# EAGLE schematic rt1060r2 (EAGLE 9.6.2), part 1 of 2

## Sheet 1 of 15
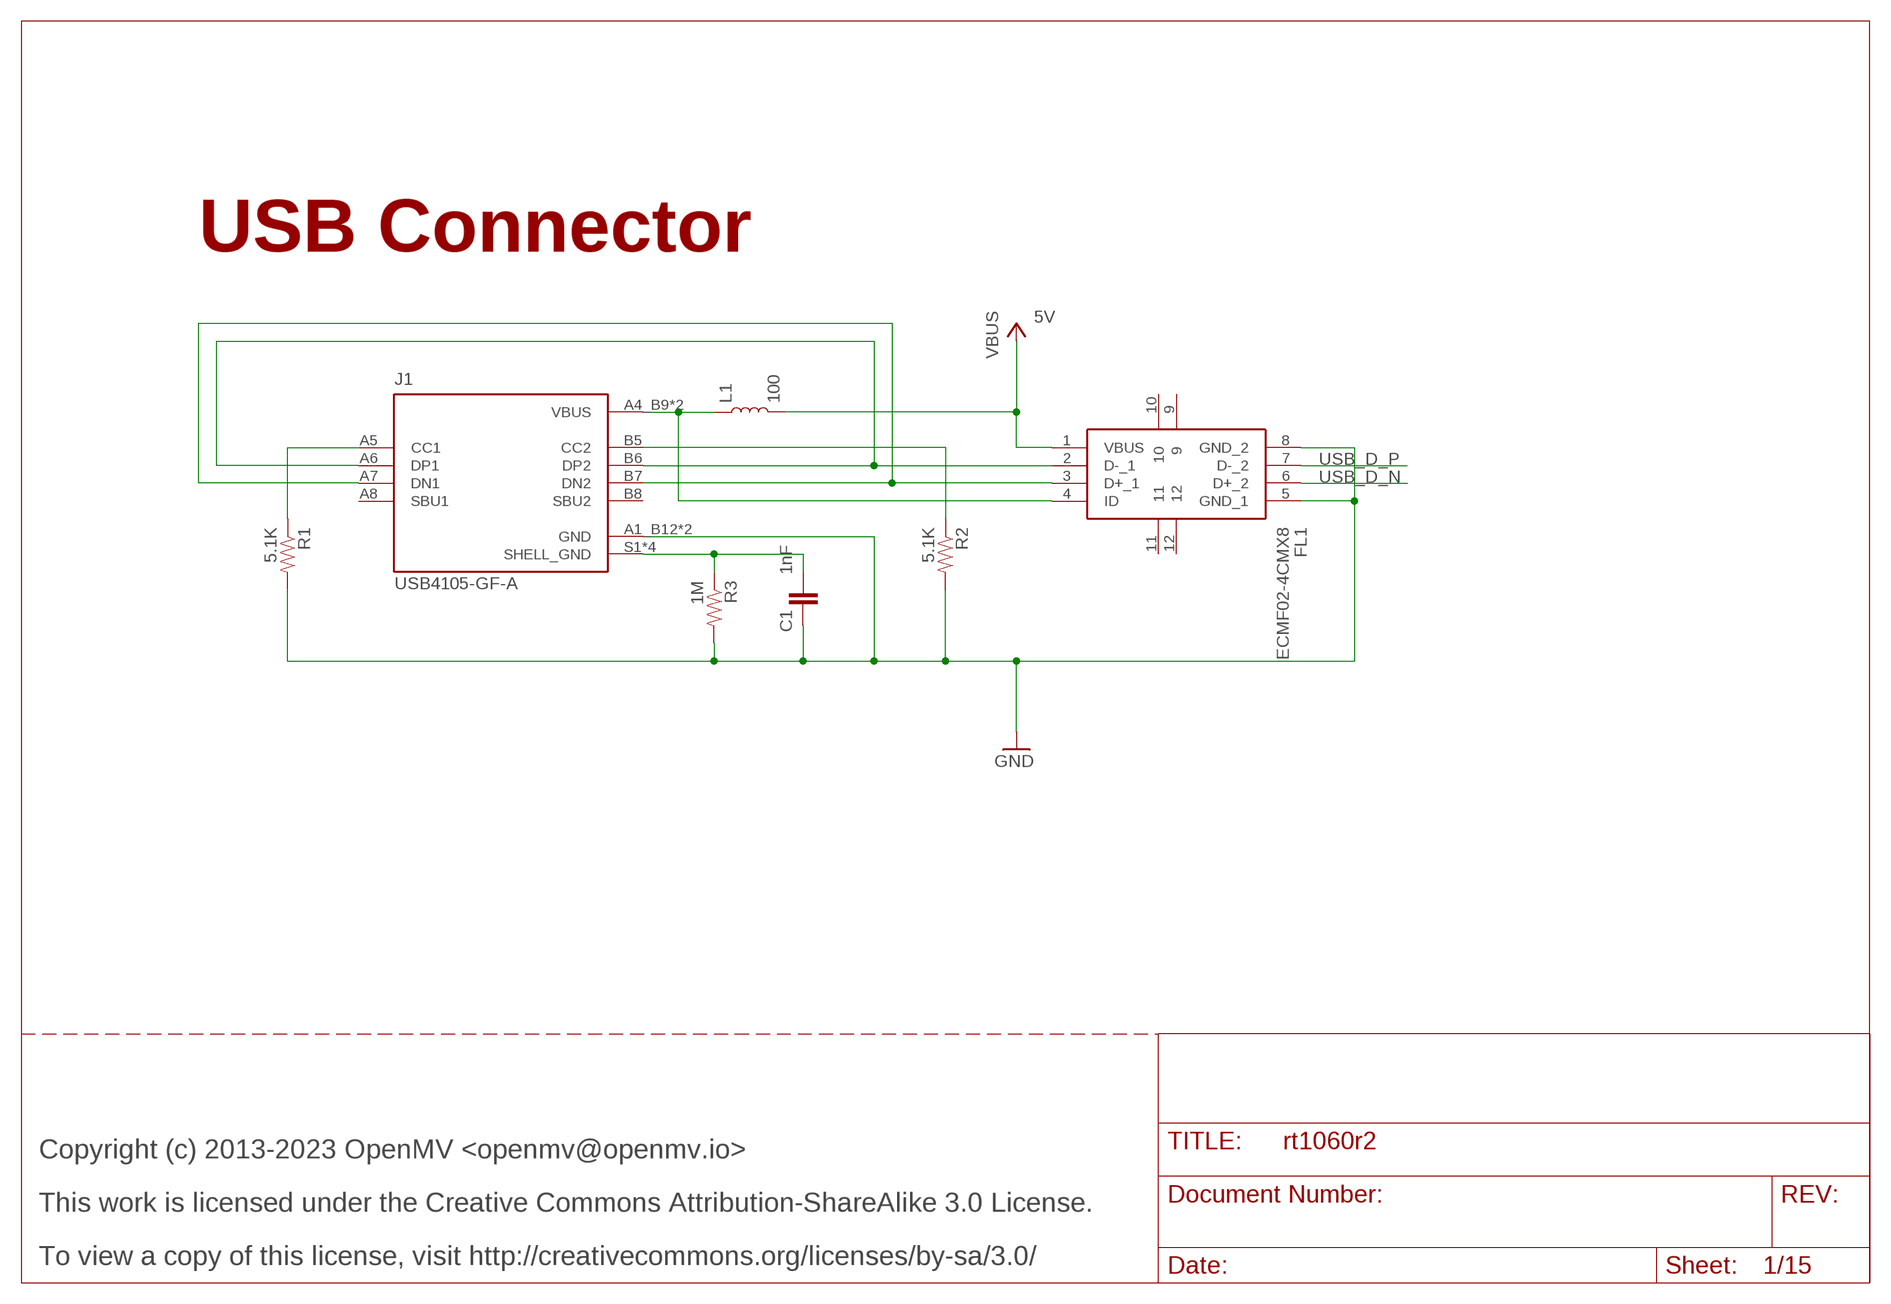
[diagram p0: schematic, sheet 1]

### Parts
C1  1nF  CAP_0402  [0402]
FL1  ECMF02-4CMX8  [ECMF024CMX8]
J1  USB4105-GF-A  [GCT_USB4105-GF-A]
L1  100  INDUCTOR-0603-33NH  [0603]
R1  5.1K  RES_0402  [0402]
R2  5.1K  RES_0402  [0402]
R3  1M  RES_0402  [0402]

### Nets
CC1: J1.A5(CC1) R1.1
CC2: J1.B5(CC2) R2.1
D_N [usb]: FL1.3(D+_1) J1.A7(DN1) J1.B7(DN2)
D_P [usb]: FL1.2(D-_1) J1.A6(DP1) J1.B6(DP2)
GND [gnd]: C1.1 FL1.5(GND_1) FL1.8(GND_2) J1.A1_B12(GND) J1.B1_A12(GND) R1.2 R2.2 R3.2 ; also sheet 2,3,4,5,6,7,8,9,10,11,12,13,14,15
SHELL_GND [power]: C1.2 J1.S1(SHELL_GND) J1.S2(SHELL_GND) J1.S3(SHELL_GND) J1.S4(SHELL_GND) R3.1
USB_D_N [usb]: FL1.6(D+_2) ; also sheet 15
USB_D_P [usb]: FL1.7(D-_2) ; also sheet 15
USB_VBUS: FL1.4(ID) J1.A4_B9(VBUS) J1.B4_A9(VBUS) L1.1
VBUS: FL1.1(VBUS) L1.2 ; also sheet 2,15
Unconnected: FL1.9 FL1.10 FL1.11 FL1.12 J1.A8(SBU1) J1.B8(SBU2)

### Notes on the sheet
- USB Connector
- 5V
- Copyright (c) 2013-2023 OpenMV <openmv@openmv.io>
- This work is licensed under the Creative Commons Attribution-ShareAlike 3.0 License.
- To view a copy of this license, visit http://creativecommons.org/licenses/by-sa/3.0/

## Sheet 2 of 15
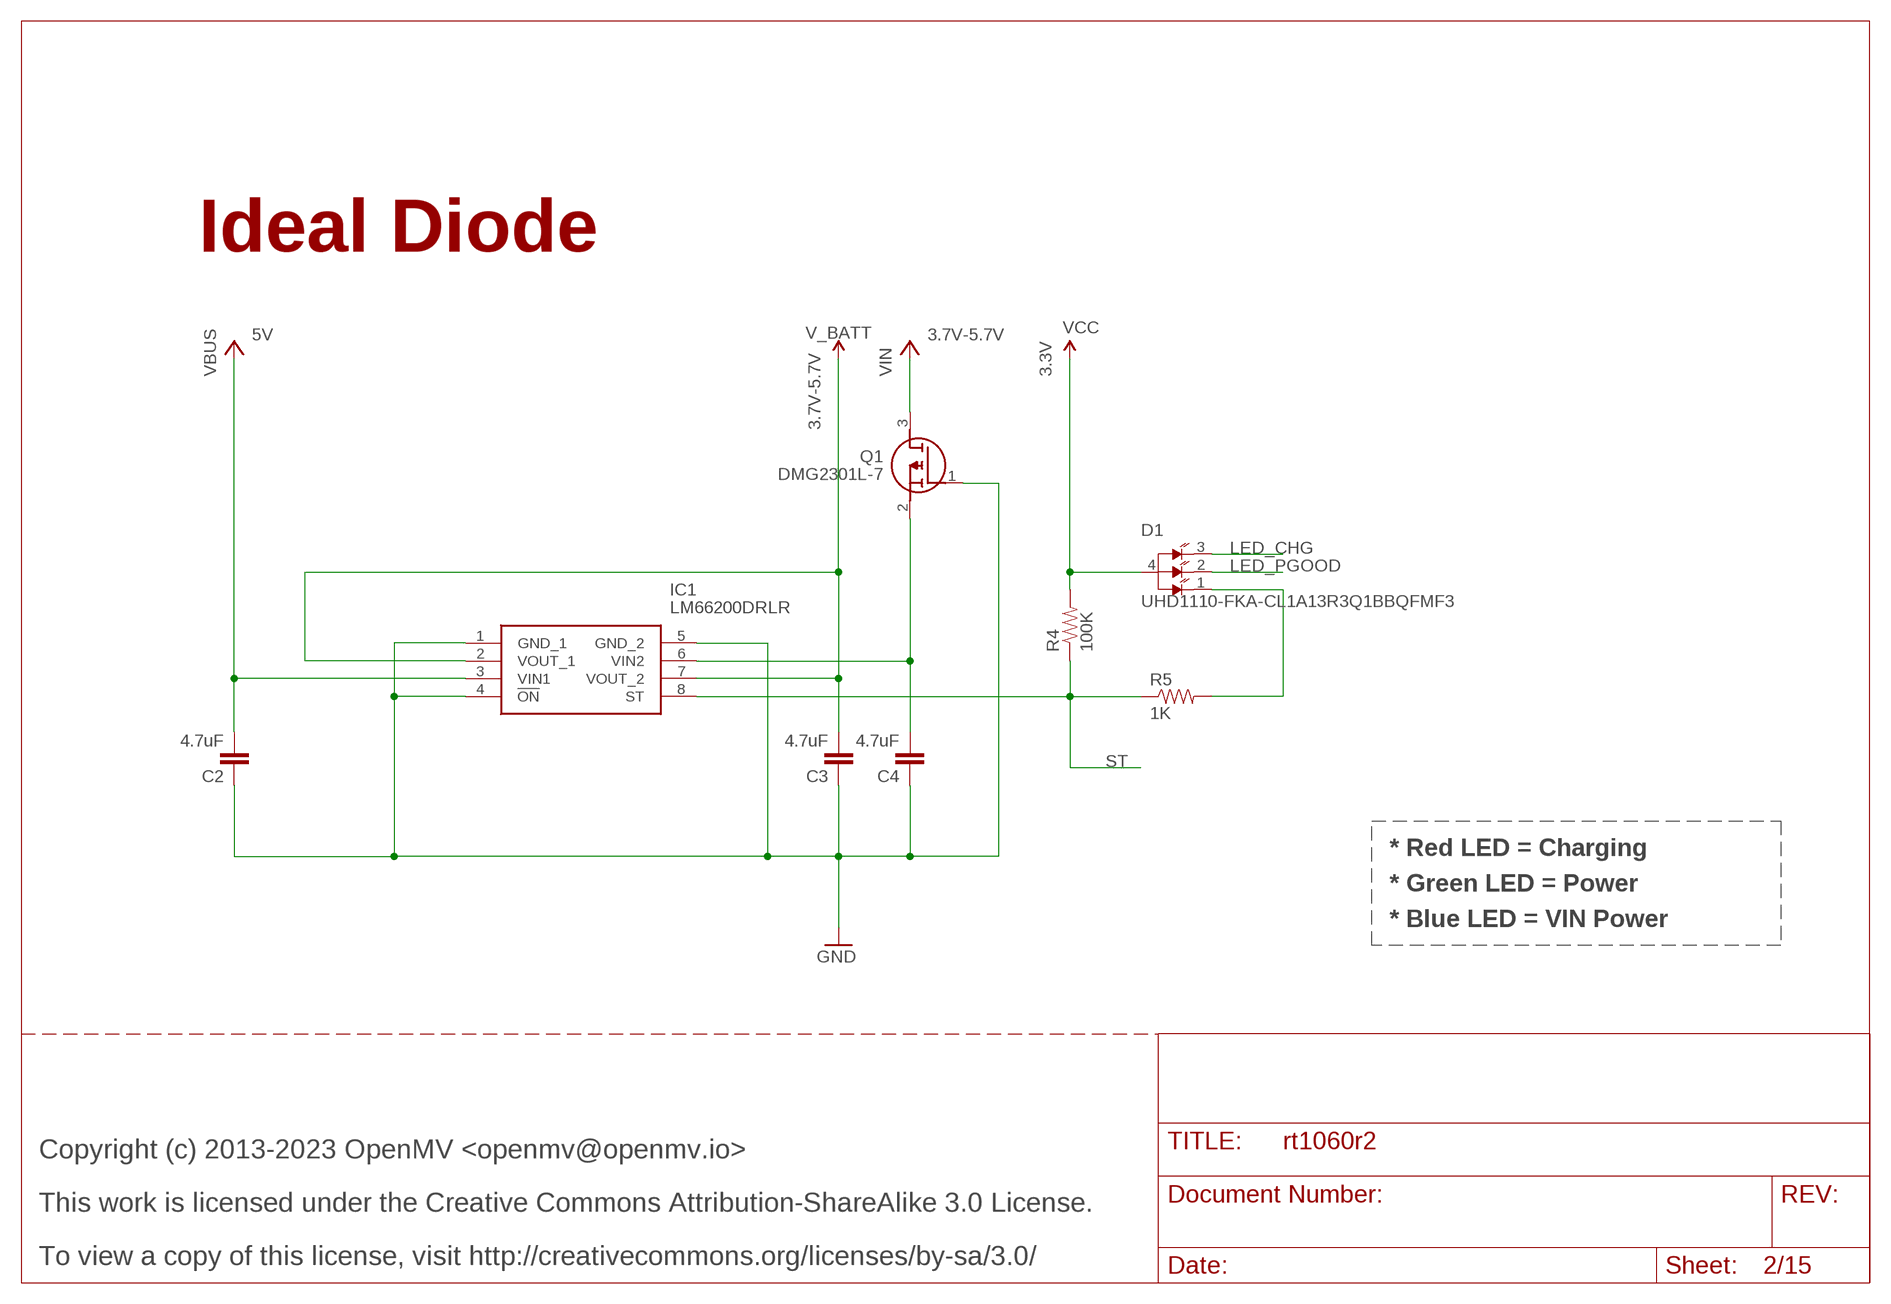
[diagram p1: schematic, sheet 2]

### Parts
C2  4.7uF  CAP_0402  [0402]
C3  4.7uF  CAP_0402  [0402]
C4  4.7uF  CAP_0402  [0402]
D1  UHD1110-FKA-CL1A13R3Q1BBQFMF3  [LED_UHD1110-FKA-CL1A13R3Q1BBQFMF3]
IC1  LM66200DRLR  [SOTFL50P160X60-8N]
Q1  DMG2301L-7  [SOT96P240X110-3N]
R4  100K  RES_0402  [0402]
R5  1K  RES_0402  [0402]

### Nets
GND [gnd]: C2.1 C3.1 C4.1 IC1.1(GND_1) IC1.4(!ON) IC1.5(GND_2) Q1.1(G) ; also sheet 1,3,4,5,6,7,8,9,10,11,12,13,14,15
LED_CHG: D1.3(RED) ; also sheet 3
LED_PGOOD: D1.2(GREEN) ; also sheet 3
LED_ST: D1.1(BLUE) R5.2
ST: IC1.8(ST) R4.1 R5.1 ; also sheet 12
V_BATT [power]: C3.2 IC1.2(VOUT_1) IC1.7(VOUT_2) ; also sheet 3
VBUS: C2.2 IC1.3(VIN1) ; also sheet 1,15
VCC: D1.4(ANODE) R4.2 ; also sheet 3,5,6,7,8,9,10,11,12,13,14,15
VIN [power]: Q1.3(D) ; also sheet 11
VIN_INT [power]: C4.2 IC1.6(VIN2) Q1.2(S)

### Notes on the sheet
- Ideal Diode
- 5V | 3.7V-5.7V
- 3.3V
- 3.7V-5.7V
- * Red LED = Charging
- * Green LED = Power
- * Blue LED = VIN Power
- Copyright (c) 2013-2023 OpenMV <openmv@openmv.io>
- This work is licensed under the Creative Commons Attribution-ShareAlike 3.0 License.
- To view a copy of this license, visit http://creativecommons.org/licenses/by-sa/3.0/

## Sheet 3 of 15
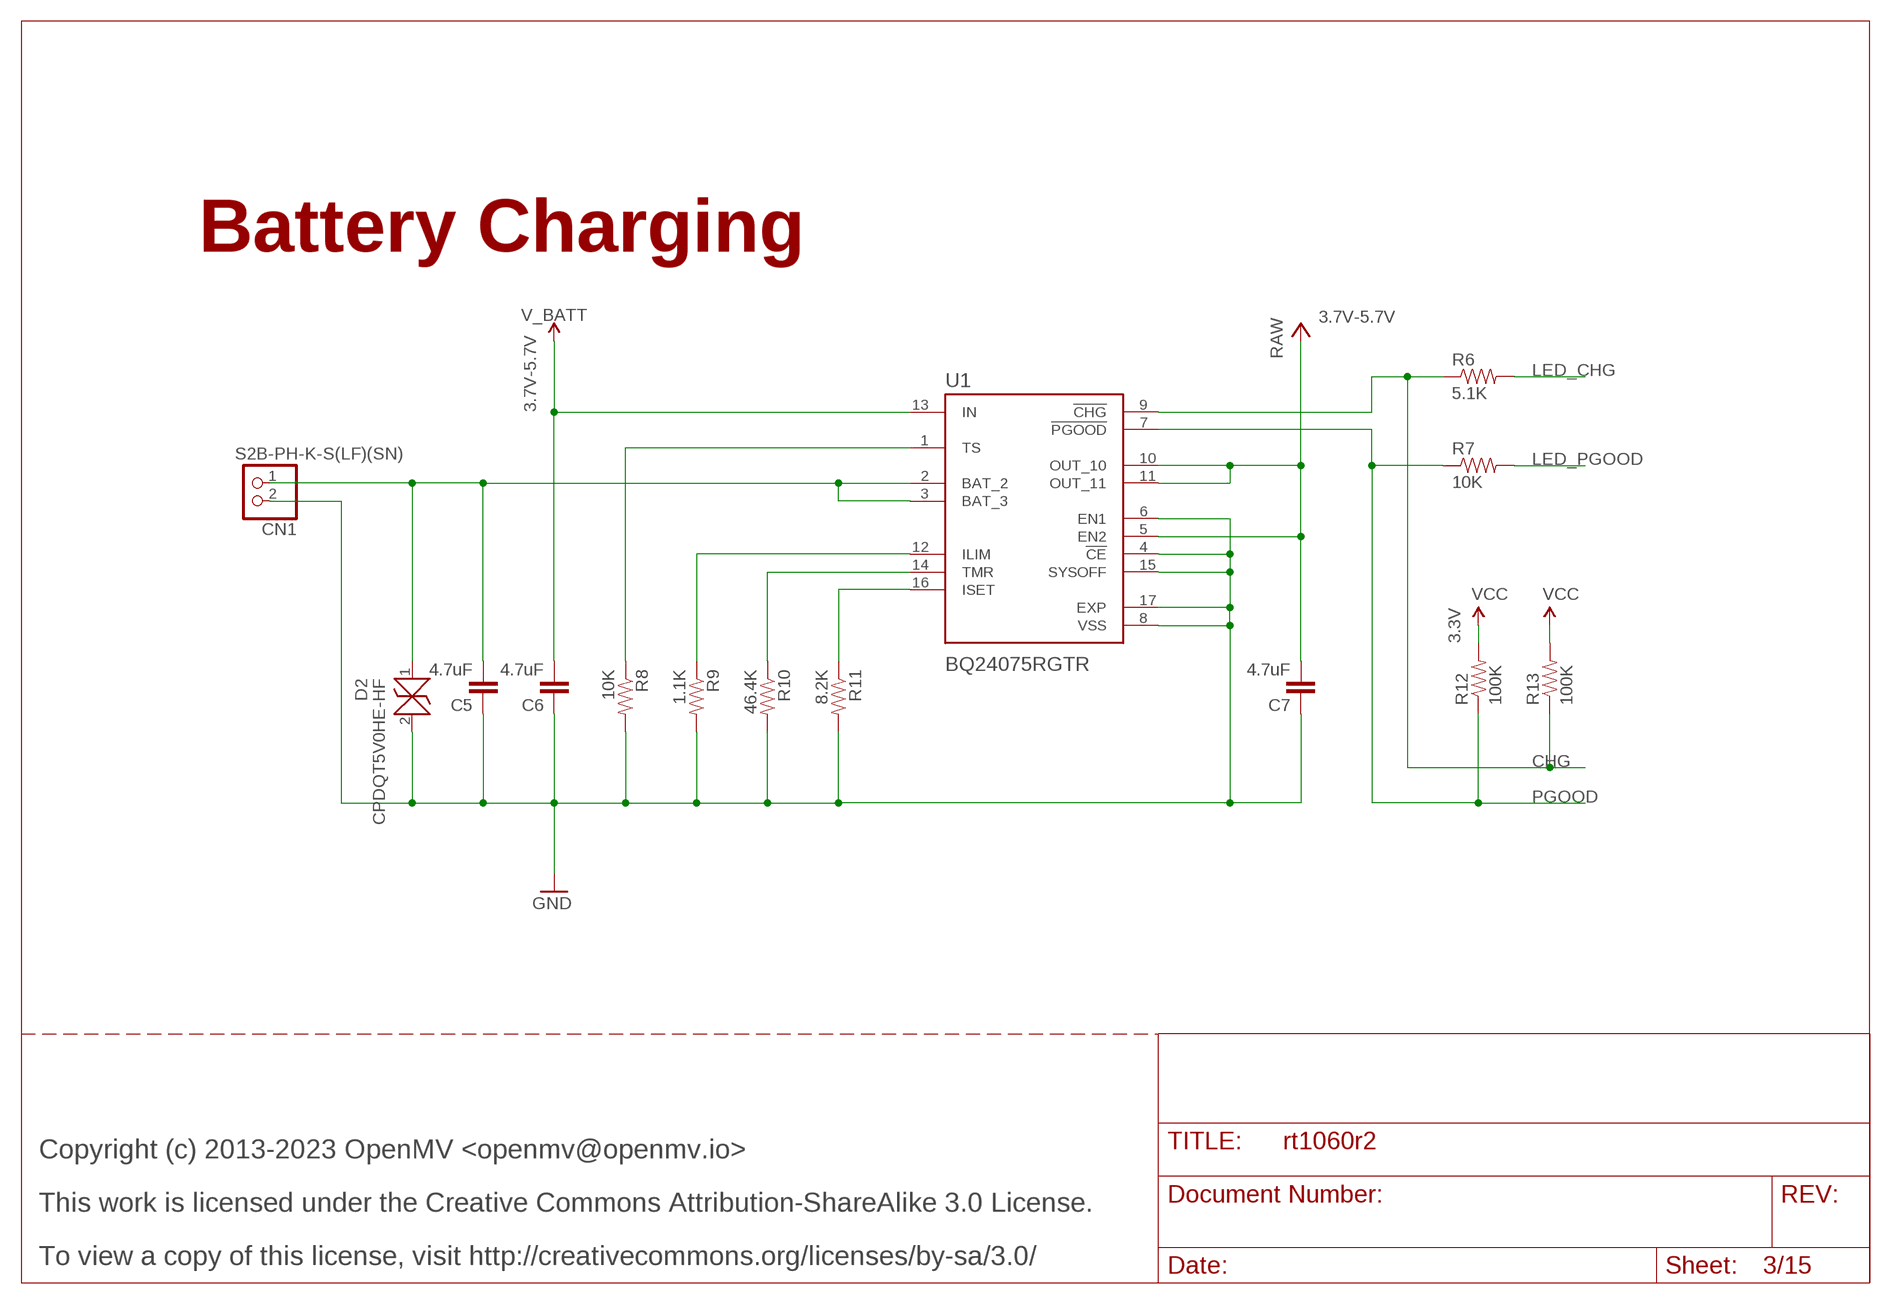
[diagram p2: schematic, sheet 3]

### Parts
C5  4.7uF  CAP_0402  [0402]
C6  4.7uF  CAP_0402  [0402]
C7  4.7uF  CAP_0402  [0402]
CN1  S2B-PH-K-S(LF)(SN)  JST_2PIN-THM-RA  [JST-PH-2-THM-RA]
D2  CPDQT5V0HE-HF  [CPDQT5V0HEHF]
R6  5.1K  RES_0402  [0402]
R7  10K  RES_0402  [0402]
R8  10K  RES_0402  [0402]
R9  1.1K  RES_0402  [0402]
R10  46.4K  RES_0402  [0402]
R11  8.2K  RES_0402  [0402]
R12  100K  RES_0402  [0402]
R13  100K  RES_0402  [0402]
U1  BQ24075RGTR  [QFN50P300X300X100-17N]

### Nets
BAT [power]: C5.2 CN1.1 D2.1 U1.2(BAT_2) U1.3(BAT_3)
CHG: R6.1 R13.1 U1.9(!CHG) ; also sheet 12
GND [gnd]: C5.1 C6.1 C7.1 CN1.2 D2.2 R8.2 R9.2 R10.2 R11.2 U1.4(!CE) U1.6(EN1) U1.8(VSS) U1.15(SYSOFF) U1.17(EXP) ; also sheet 1,2,4,5,6,7,8,9,10,11,12,13,14,15
ILIM [power]: R9.1 U1.12(ILIM)
ISET [power]: R11.1 U1.16(ISET)
LED_CHG: R6.2 ; also sheet 2
LED_PGOOD: R7.2 ; also sheet 2
PGOOD: R7.1 R12.1 U1.7(!PGOOD) ; also sheet 15
RAW: C7.2 U1.5(EN2) U1.10(OUT_10) U1.11(OUT_11) ; also sheet 4,5,11
TMR [power]: R10.1 U1.14(TMR)
TS [power]: R8.1 U1.1(TS)
V_BATT [power]: C6.2 U1.13(IN) ; also sheet 2
VCC: R12.2 R13.2 ; also sheet 2,5,6,7,8,9,10,11,12,13,14,15

### Notes on the sheet
- Battery Charging
- 3.7V-5.7V
- 3.7V-5.7V
- 3.3V
- Copyright (c) 2013-2023 OpenMV <openmv@openmv.io>
- This work is licensed under the Creative Commons Attribution-ShareAlike 3.0 License.
- To view a copy of this license, visit http://creativecommons.org/licenses/by-sa/3.0/

## Sheet 4 of 15
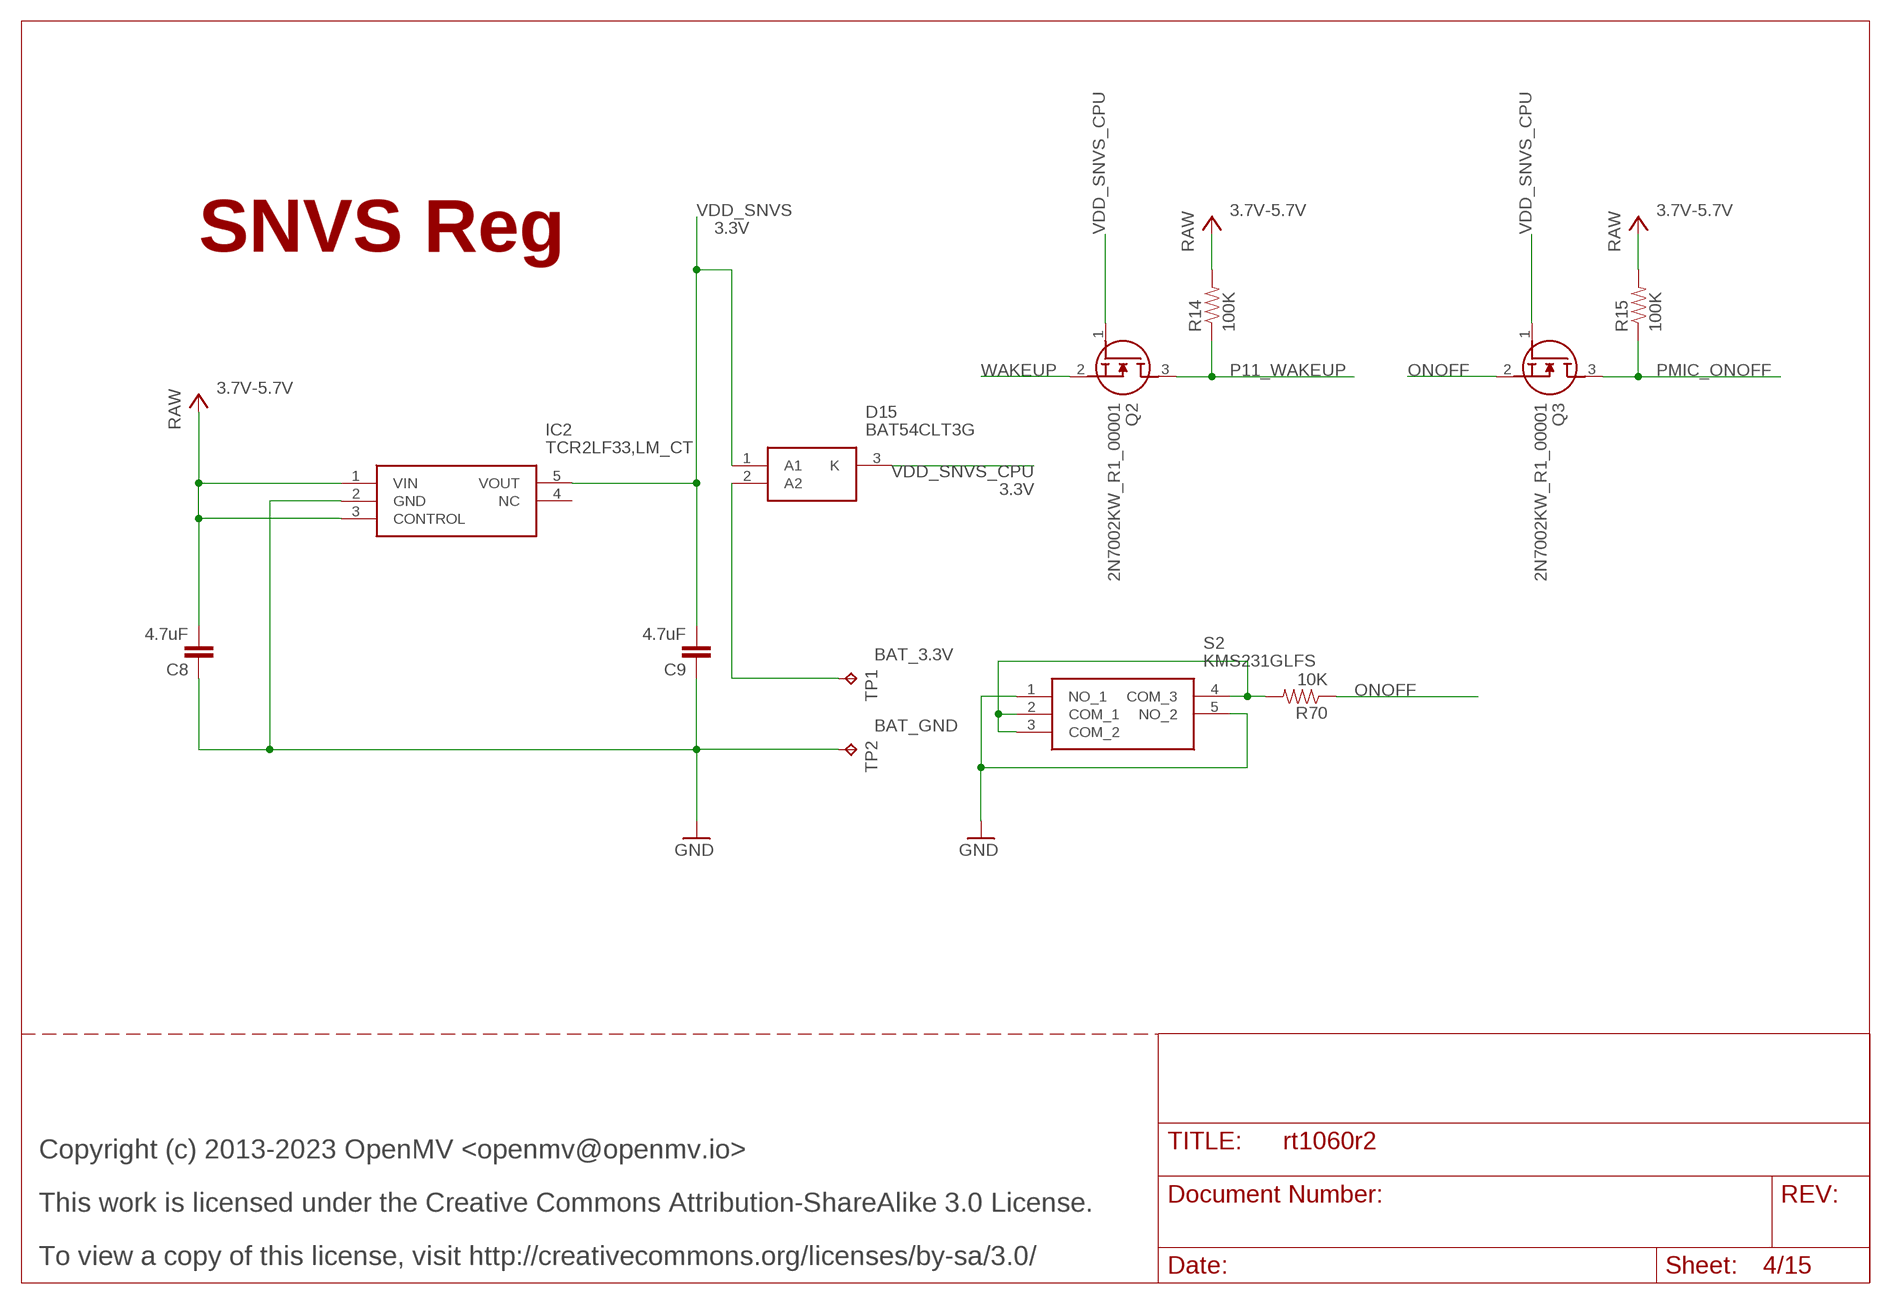
[diagram p3: schematic, sheet 4]

### Parts
C8  4.7uF  CAP_0402  [0402]
C9  4.7uF  CAP_0402  [0402]
D15  BAT54CLT3G  [SOT96P237X111-3N]
IC2  TCR2LF33,LM_CT  [TCR2LF33LMCT]
Q2  2N7002KW_R1_00001  [SOT65P210X110-3N]
Q3  2N7002KW_R1_00001  [SOT65P210X110-3N]
R14  100K  RES_0402  [0402]
R15  100K  RES_0402  [0402]
R70  10K  RES_0402  [0402]
S2  KMS231GLFS  [KMS231GLFS]
TP1  TPTP10R  [TP10R]
TP2  TPTP10R  [TP10R]

### Nets
GND [gnd]: C8.1 C9.1 IC2.2(GND) S2.1(NO_1) S2.5(NO_2) TP2.TP ; also sheet 1,2,3,5,6,7,8,9,10,11,12,13,14,15
ONOFF: Q3.2(S) R70.1 ; also sheet 15
ONOFF_BUTTON: R70.2 S2.2(COM_1) S2.3(COM_2) S2.4(COM_3)
P11_WAKEUP: Q2.3(D) R14.1 ; also sheet 11
PMIC_ONOFF: Q3.3(D) R15.1 ; also sheet 11
RAW: C8.2 IC2.1(VIN) IC2.3(CONTROL) R14.2 R15.2 ; also sheet 3,5,11
SNVS_BAT: D15.2(A2) TP1.TP
VDD_SNVS: C9.2 D15.1(A1) IC2.5(VOUT)
VDD_SNVS_CPU: D15.3(K) Q2.1(G) Q3.1(G) ; also sheet 5,15
WAKEUP: Q2.2(S) ; also sheet 15
Unconnected: IC2.4(NC)

### Notes on the sheet
- 3.7V-5.7V | 3.7V-5.7V
- 3.3V
- SNVS Reg
- 3.7V-5.7V
- 3.3V
- BAT_3.3V
- BAT_GND
- Copyright (c) 2013-2023 OpenMV <openmv@openmv.io>
- This work is licensed under the Creative Commons Attribution-ShareAlike 3.0 License.
- To view a copy of this license, visit http://creativecommons.org/licenses/by-sa/3.0/

## Sheet 5 of 15
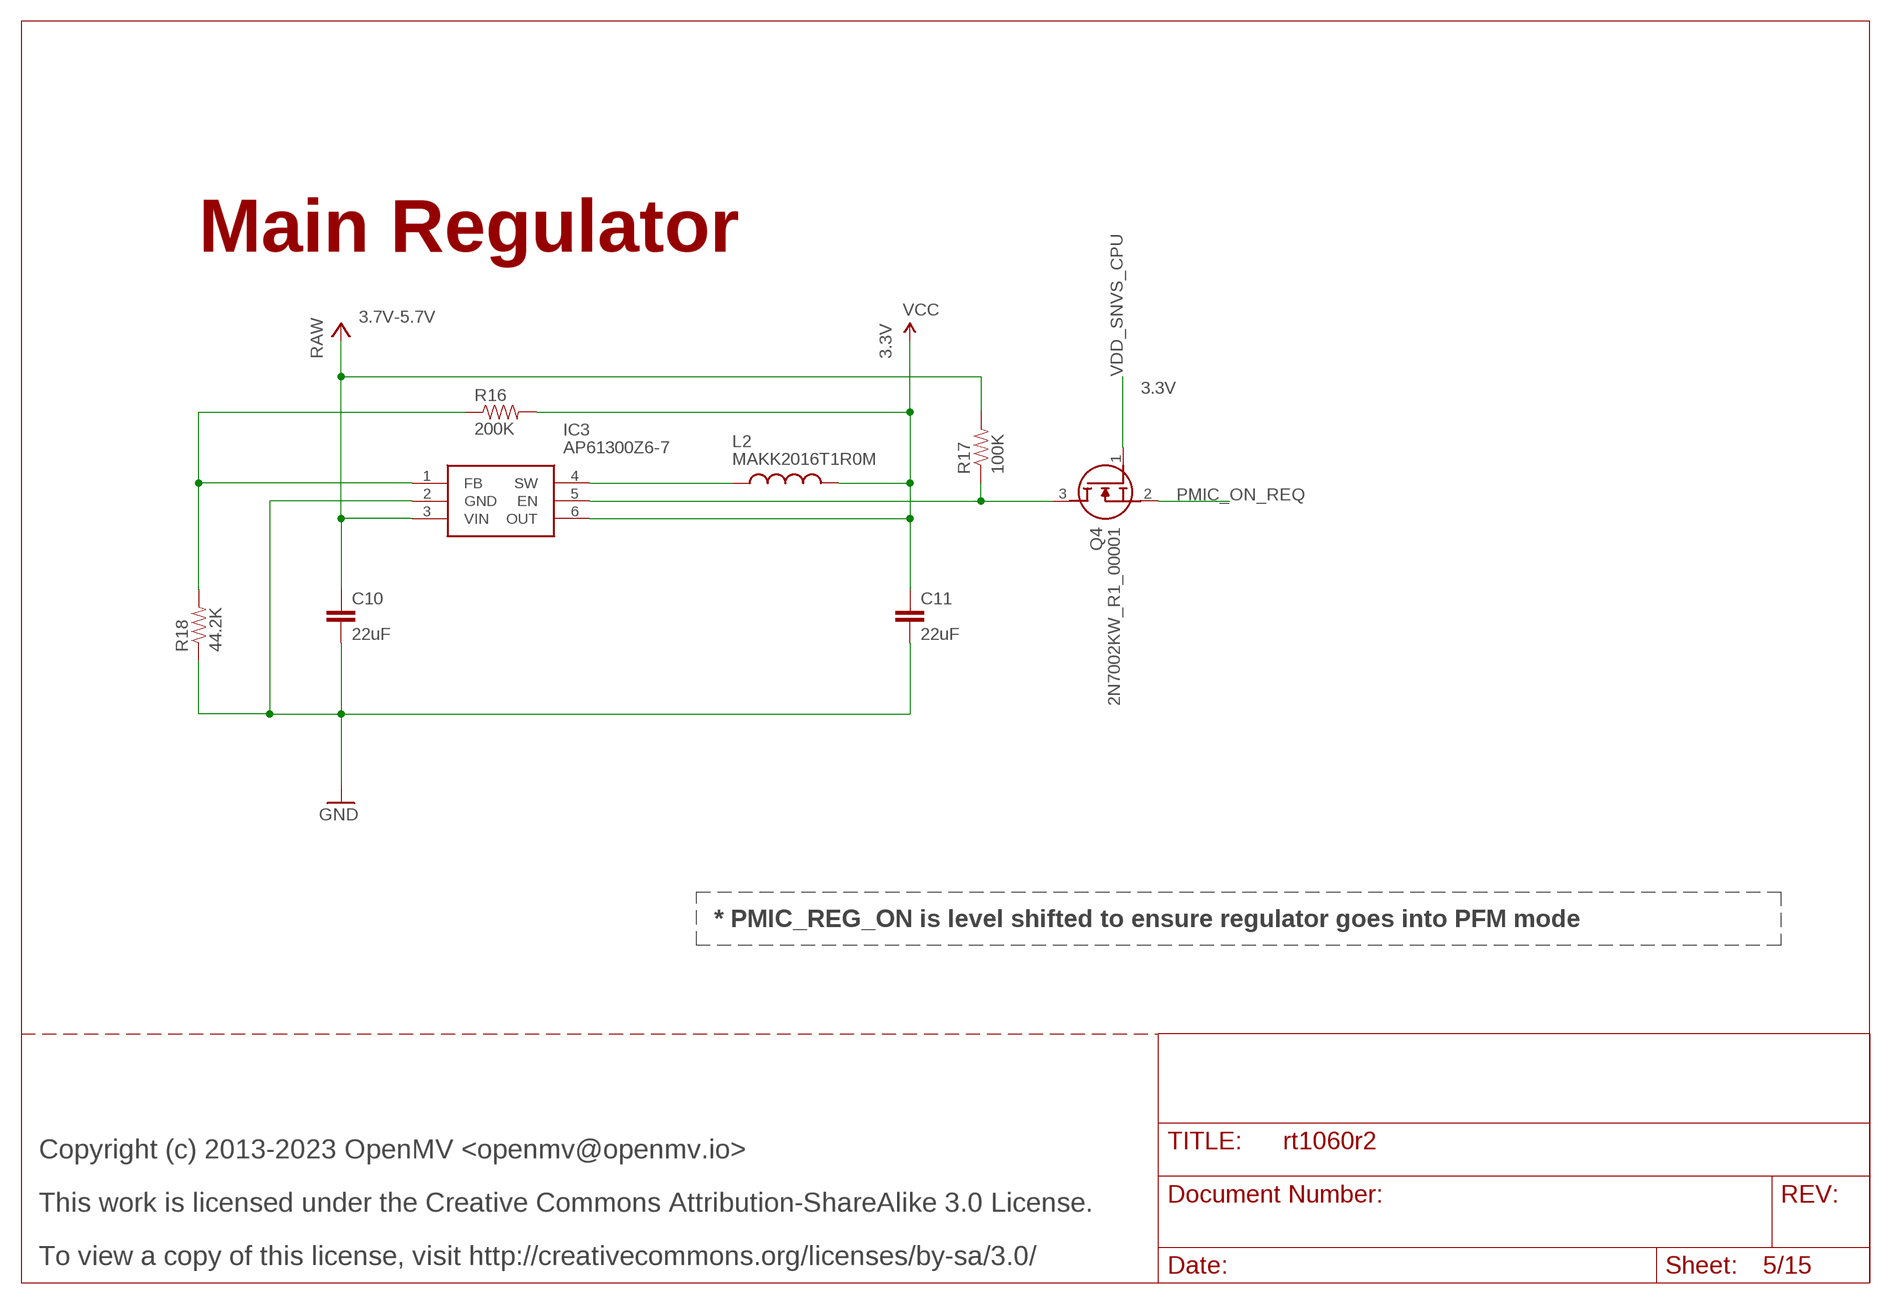
[diagram p4: schematic, sheet 5]

### Parts
C10  22uF  22UF-0805-6.3V-20%  [0805]
C11  22uF  22UF-0805-6.3V-20%  [0805]
IC3  AP61300Z6-7  [SOTFL50P162X60-6N]
L2  MAKK2016T1R0M  [INDC2016X100N]
Q4  2N7002KW_R1_00001  [SOT65P210X110-3N]
R16  200K  RES_0402  [0402]
R17  100K  RES_0402  [0402]
R18  44.2K  RES_0402  [0402]

### Nets
EN: IC3.5(EN) Q4.3(D) R17.1
FB [power]: IC3.1(FB) R16.1 R18.2
GND [gnd]: C10.2 C11.2 IC3.2(GND) R18.1 ; also sheet 1,2,3,4,6,7,8,9,10,11,12,13,14,15
PMIC_ON_REQ: Q4.2(S) ; also sheet 15
RAW: C10.1 IC3.3(VIN) R17.2 ; also sheet 3,4,11
SW [power]: IC3.4(SW) L2.1
VCC: C11.1 IC3.6(OUT) L2.2 R16.2 ; also sheet 2,3,6,7,8,9,10,11,12,13,14,15
VDD_SNVS_CPU: Q4.1(G) ; also sheet 4,15

### Notes on the sheet
- Main Regulator
- 3.7V-5.7V
- 3.3V
- 3.3V
- * PMIC_REG_ON is level shifted to ensure regulator goes into PFM mode
- Copyright (c) 2013-2023 OpenMV <openmv@openmv.io>
- This work is licensed under the Creative Commons Attribution-ShareAlike 3.0 License.
- To view a copy of this license, visit http://creativecommons.org/licenses/by-sa/3.0/

## Sheet 6 of 15
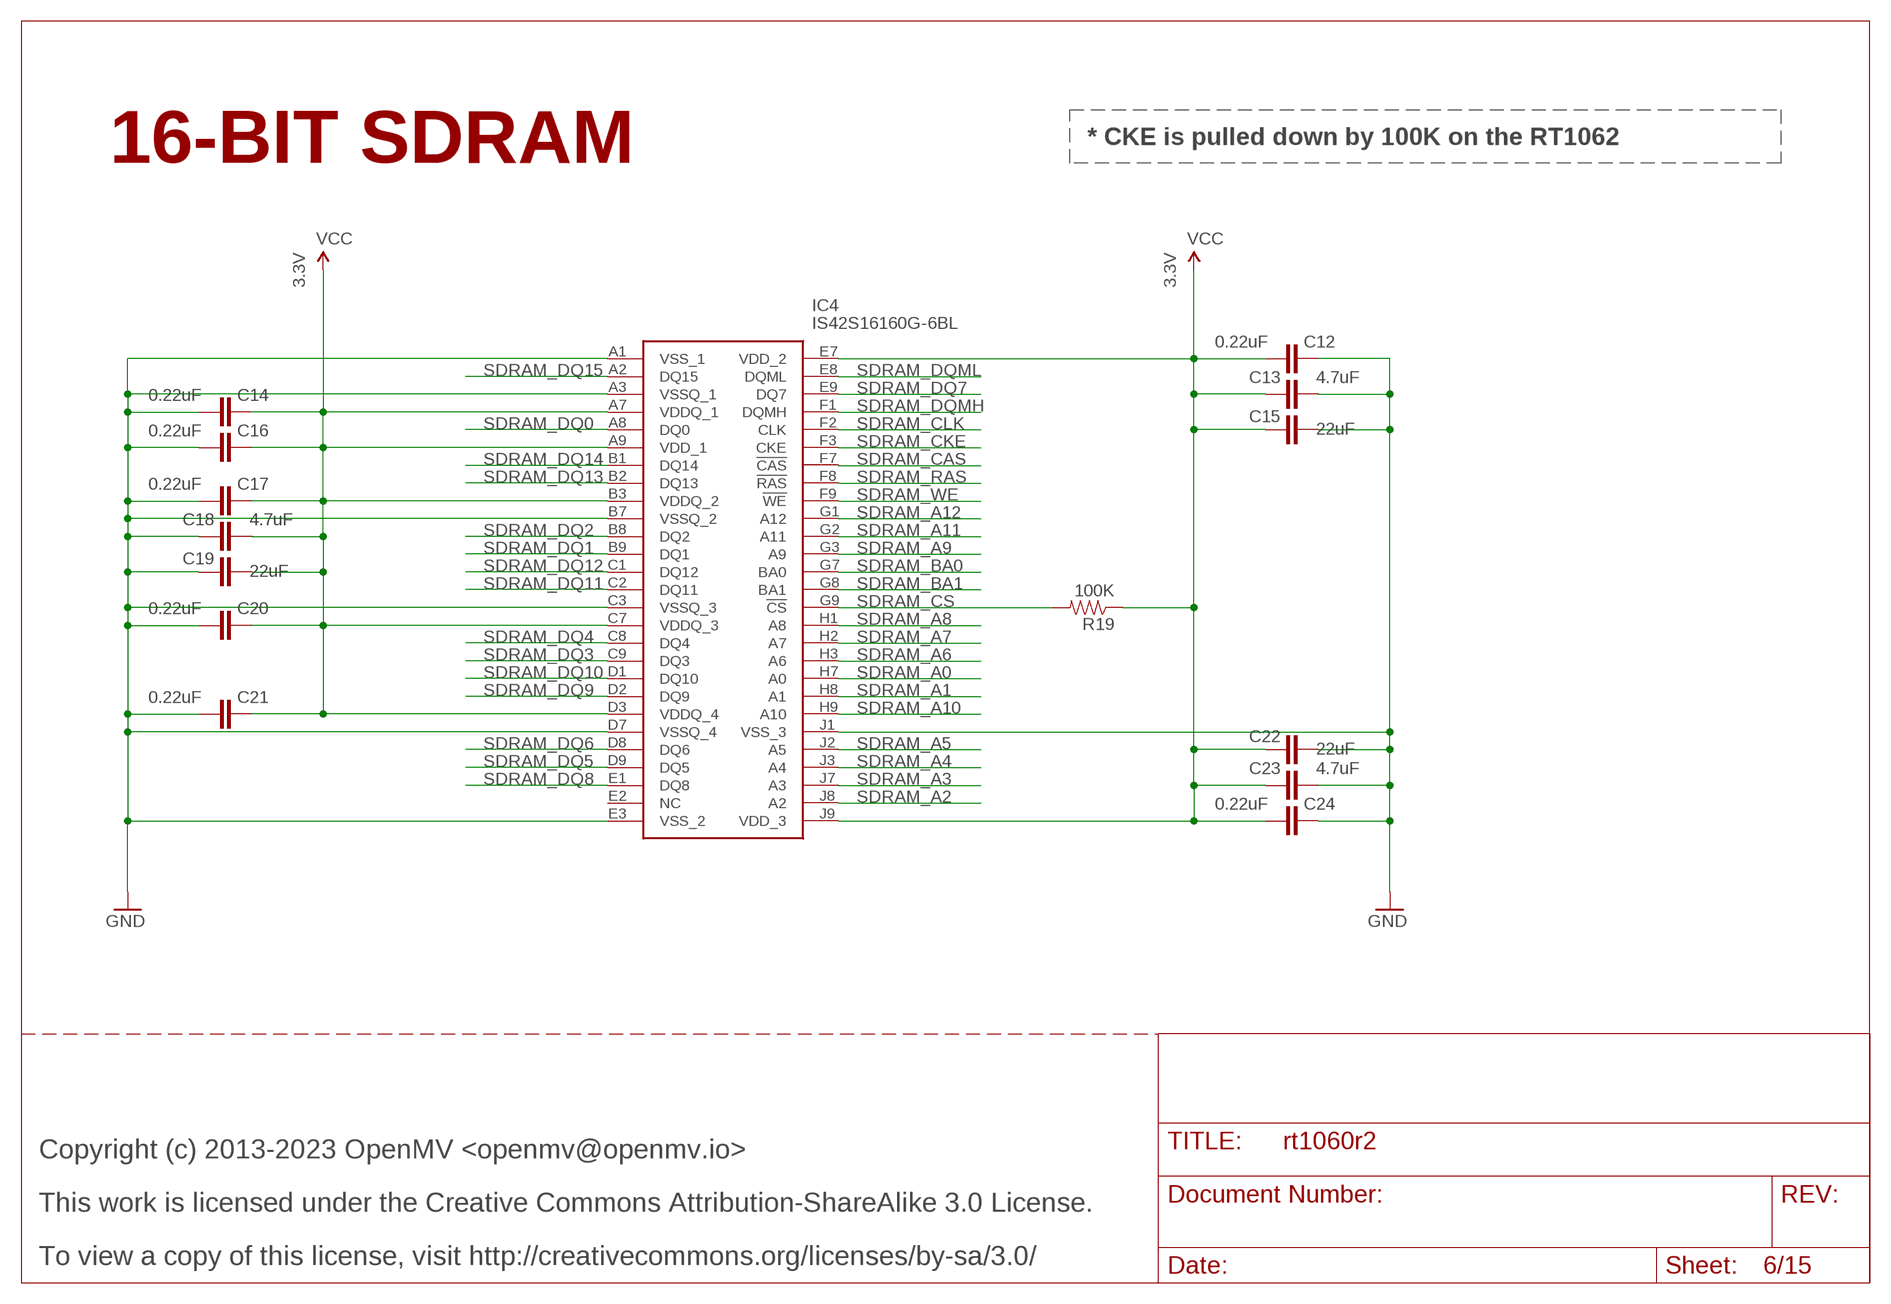
[diagram p5: schematic, sheet 6]

### Parts
C12  0.22uF  C-EUC0201  [C0201]
C13  4.7uF  CAP_0402  [0402]
C14  0.22uF  C-EUC0201  [C0201]
C15  22uF  22UF-0805-6.3V-20%  [0805]
C16  0.22uF  C-EUC0201  [C0201]
C17  0.22uF  C-EUC0201  [C0201]
C18  4.7uF  CAP_0402  [0402]
C19  22uF  22UF-0805-6.3V-20%  [0805]
C20  0.22uF  C-EUC0201  [C0201]
C21  0.22uF  C-EUC0201  [C0201]
C22  22uF  22UF-0805-6.3V-20%  [0805]
C23  4.7uF  CAP_0402  [0402]
C24  0.22uF  C-EUC0201  [C0201]
IC4  IS42S16160G-6BL  [BGA54C80P9X9_800X800X120]
R19  100K  RES_0402  [0402]

### Nets
GND [gnd]: C12.1 C13.2 C14.2 C15.2 C16.2 C17.2 C18.1 C19.1 C20.2 C21.2 C22.2 C23.2 C24.1 IC4.A1(VSS_1) IC4.A3(VSSQ_1) IC4.B7(VSSQ_2) IC4.C3(VSSQ_3) IC4.D7(VSSQ_4) IC4.E3(VSS_2) IC4.J1(VSS_3) ; also sheet 1,2,3,4,5,7,8,9,10,11,12,13,14,15
SDRAM_A0 [sdram]: IC4.H7(A0) ; also sheet 15
SDRAM_A1 [sdram]: IC4.H8(A1) ; also sheet 15
SDRAM_A2 [sdram]: IC4.J8(A2) ; also sheet 15
SDRAM_A3 [sdram]: IC4.J7(A3) ; also sheet 15
SDRAM_A4 [sdram]: IC4.J3(A4) ; also sheet 15
SDRAM_A5 [sdram]: IC4.J2(A5) ; also sheet 15
SDRAM_A6 [sdram]: IC4.H3(A6) ; also sheet 15
SDRAM_A7 [sdram]: IC4.H2(A7) ; also sheet 15
SDRAM_A8 [sdram]: IC4.H1(A8) ; also sheet 15
SDRAM_A9 [sdram]: IC4.G3(A9) ; also sheet 15
SDRAM_A10 [sdram]: IC4.H9(A10) ; also sheet 15
SDRAM_A11 [sdram]: IC4.G2(A11) ; also sheet 15
SDRAM_A12 [sdram]: IC4.G1(A12) ; also sheet 15
SDRAM_BA0 [sdram]: IC4.G7(BA0) ; also sheet 15
SDRAM_BA1 [sdram]: IC4.G8(BA1) ; also sheet 15
SDRAM_CAS [sdram]: IC4.F7(!CAS) ; also sheet 15
SDRAM_CKE [sdram]: IC4.F3(CKE) ; also sheet 15
SDRAM_CLK [sdram]: IC4.F2(CLK) ; also sheet 15
SDRAM_CS [sdram]: IC4.G9(!CS) R19.2 ; also sheet 15
SDRAM_DQ0 [sdram]: IC4.A8(DQ0) ; also sheet 15
SDRAM_DQ1 [sdram]: IC4.B9(DQ1) ; also sheet 15
SDRAM_DQ2 [sdram]: IC4.B8(DQ2) ; also sheet 15
SDRAM_DQ3 [sdram]: IC4.C9(DQ3) ; also sheet 15
SDRAM_DQ4 [sdram]: IC4.C8(DQ4) ; also sheet 15
SDRAM_DQ5 [sdram]: IC4.D9(DQ5) ; also sheet 15
SDRAM_DQ6 [sdram]: IC4.D8(DQ6) ; also sheet 15
SDRAM_DQ7 [sdram]: IC4.E9(DQ7) ; also sheet 15
SDRAM_DQ8 [sdram]: IC4.E1(DQ8) ; also sheet 15
SDRAM_DQ9 [sdram]: IC4.D2(DQ9) ; also sheet 15
SDRAM_DQ10 [sdram]: IC4.D1(DQ10) ; also sheet 15
SDRAM_DQ11 [sdram]: IC4.C2(DQ11) ; also sheet 15
SDRAM_DQ12 [sdram]: IC4.C1(DQ12) ; also sheet 15
SDRAM_DQ13 [sdram]: IC4.B2(DQ13) ; also sheet 15
SDRAM_DQ14 [sdram]: IC4.B1(DQ14) ; also sheet 15
SDRAM_DQ15 [sdram]: IC4.A2(DQ15) ; also sheet 15
SDRAM_DQMH [sdram]: IC4.F1(DQMH) ; also sheet 15
SDRAM_DQML [sdram]: IC4.E8(DQML) ; also sheet 15
SDRAM_RAS [sdram]: IC4.F8(!RAS) ; also sheet 15
SDRAM_WE [sdram]: IC4.F9(!WE) ; also sheet 15
VCC: C12.2 C13.1 C14.1 C15.1 C16.1 C17.1 C18.2 C19.2 C20.1 C21.1 C22.1 C23.1 C24.2 IC4.A7(VDDQ_1) IC4.A9(VDD_1) IC4.B3(VDDQ_2) IC4.C7(VDDQ_3) IC4.D3(VDDQ_4) IC4.E7(VDD_2) IC4.J9(VDD_3) R19.1 ; also sheet 2,3,5,7,8,9,10,11,12,13,14,15
Unconnected: IC4.E2(NC)

### Notes on the sheet
- * CKE is pulled down by 100K on the RT1062
- 16-BIT SDRAM
- 3.3V | 3.3V
- Copyright (c) 2013-2023 OpenMV <openmv@openmv.io>
- This work is licensed under the Creative Commons Attribution-ShareAlike 3.0 License.
- To view a copy of this license, visit http://creativecommons.org/licenses/by-sa/3.0/

## Sheet 7 of 15
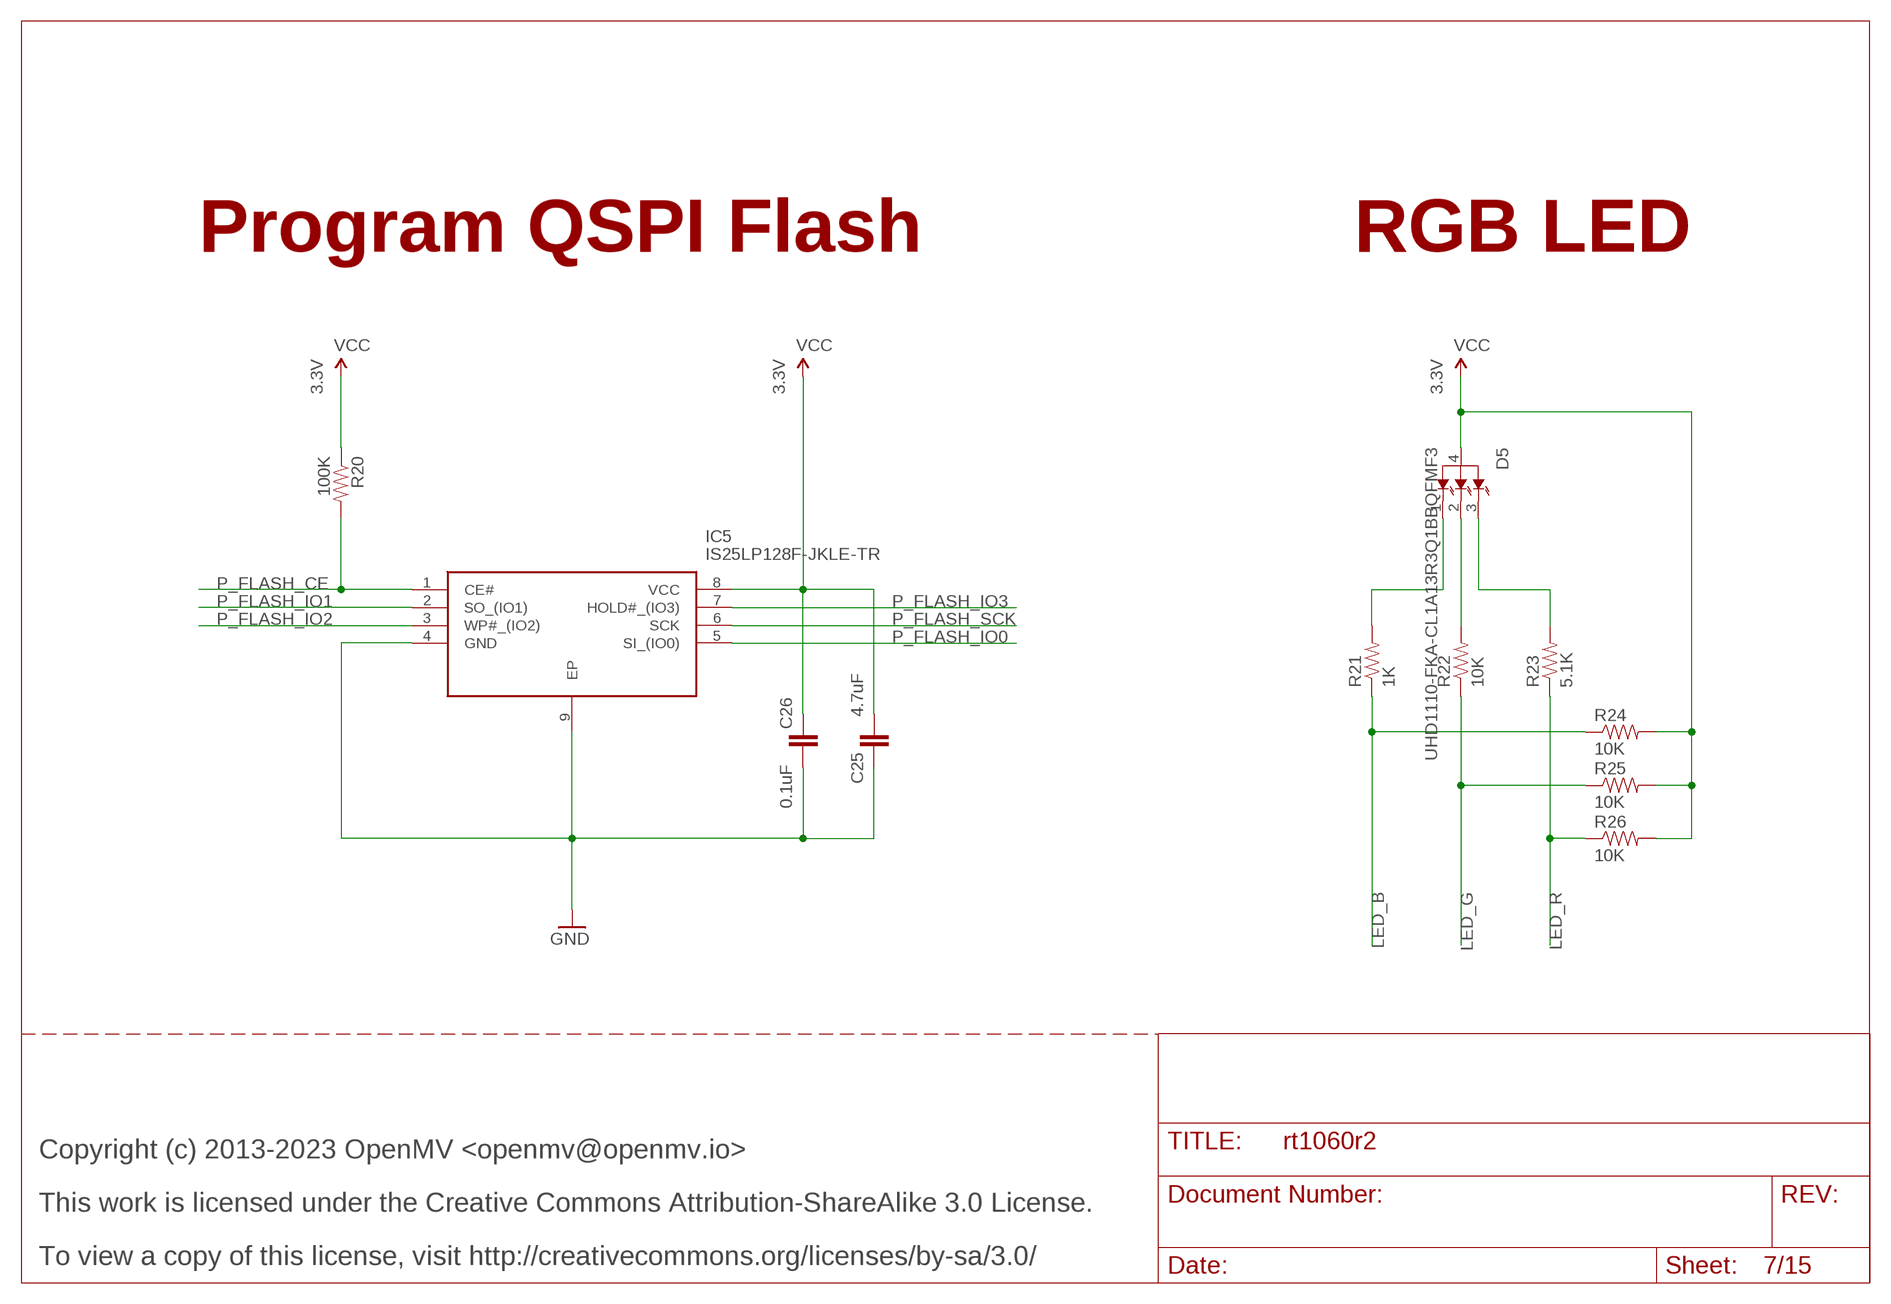
[diagram p6: schematic, sheet 7]

### Parts
C25  4.7uF  CAP_0402  [0402]
C26  0.1uF  CAP_0402  [0402]
D5  UHD1110-FKA-CL1A13R3Q1BBQFMF3  [LED_UHD1110-FKA-CL1A13R3Q1BBQFMF3]
IC5  IS25LP128F-JKLE-TR  IS25LP064D-JKLE-TR  [SON127P500X595X80-9N]
R20  100K  RES_0402  [0402]
R21  1K  RES_0402  [0402]
R22  10K  RES_0402  [0402]
R23  5.1K  RES_0402  [0402]
R24  10K  RES_0402  [0402]
R25  10K  RES_0402  [0402]
R26  10K  RES_0402  [0402]

### Nets
GND [gnd]: C25.1 C26.2 IC5.4(GND) IC5.9(EP) ; also sheet 1,2,3,4,5,6,8,9,10,11,12,13,14,15
LED_B: R21.1 R24.1 ; also sheet 15
LED_B_INT: D5.1(BLUE) R21.2
LED_G: R22.1 R25.1 ; also sheet 15
LED_G_INT: D5.2(GREEN) R22.2
LED_R: R23.1 R26.1 ; also sheet 15
LED_R_INT: D5.3(RED) R23.2
P_FLASH_CE [flash]: IC5.1(CE#) R20.2 ; also sheet 15
P_FLASH_IO0 [flash]: IC5.5(SI_(IO0)) ; also sheet 15
P_FLASH_IO1 [flash]: IC5.2(SO_(IO1)) ; also sheet 15
P_FLASH_IO2 [flash]: IC5.3(WP#_(IO2)) ; also sheet 15
P_FLASH_IO3 [flash]: IC5.7(HOLD#_(IO3)) ; also sheet 15
P_FLASH_SCK [flash]: IC5.6(SCK) ; also sheet 15
VCC: C25.2 C26.1 D5.4(ANODE) IC5.8(VCC) R20.1 R24.2 R25.2 R26.2 ; also sheet 2,3,5,6,8,9,10,11,12,13,14,15

### Notes on the sheet
- Program QSPI Flash | RGB LED
- 3.3V | 3.3V | 3.3V
- Copyright (c) 2013-2023 OpenMV <openmv@openmv.io>
- This work is licensed under the Creative Commons Attribution-ShareAlike 3.0 License.
- To view a copy of this license, visit http://creativecommons.org/licenses/by-sa/3.0/

## Sheet 8 of 15
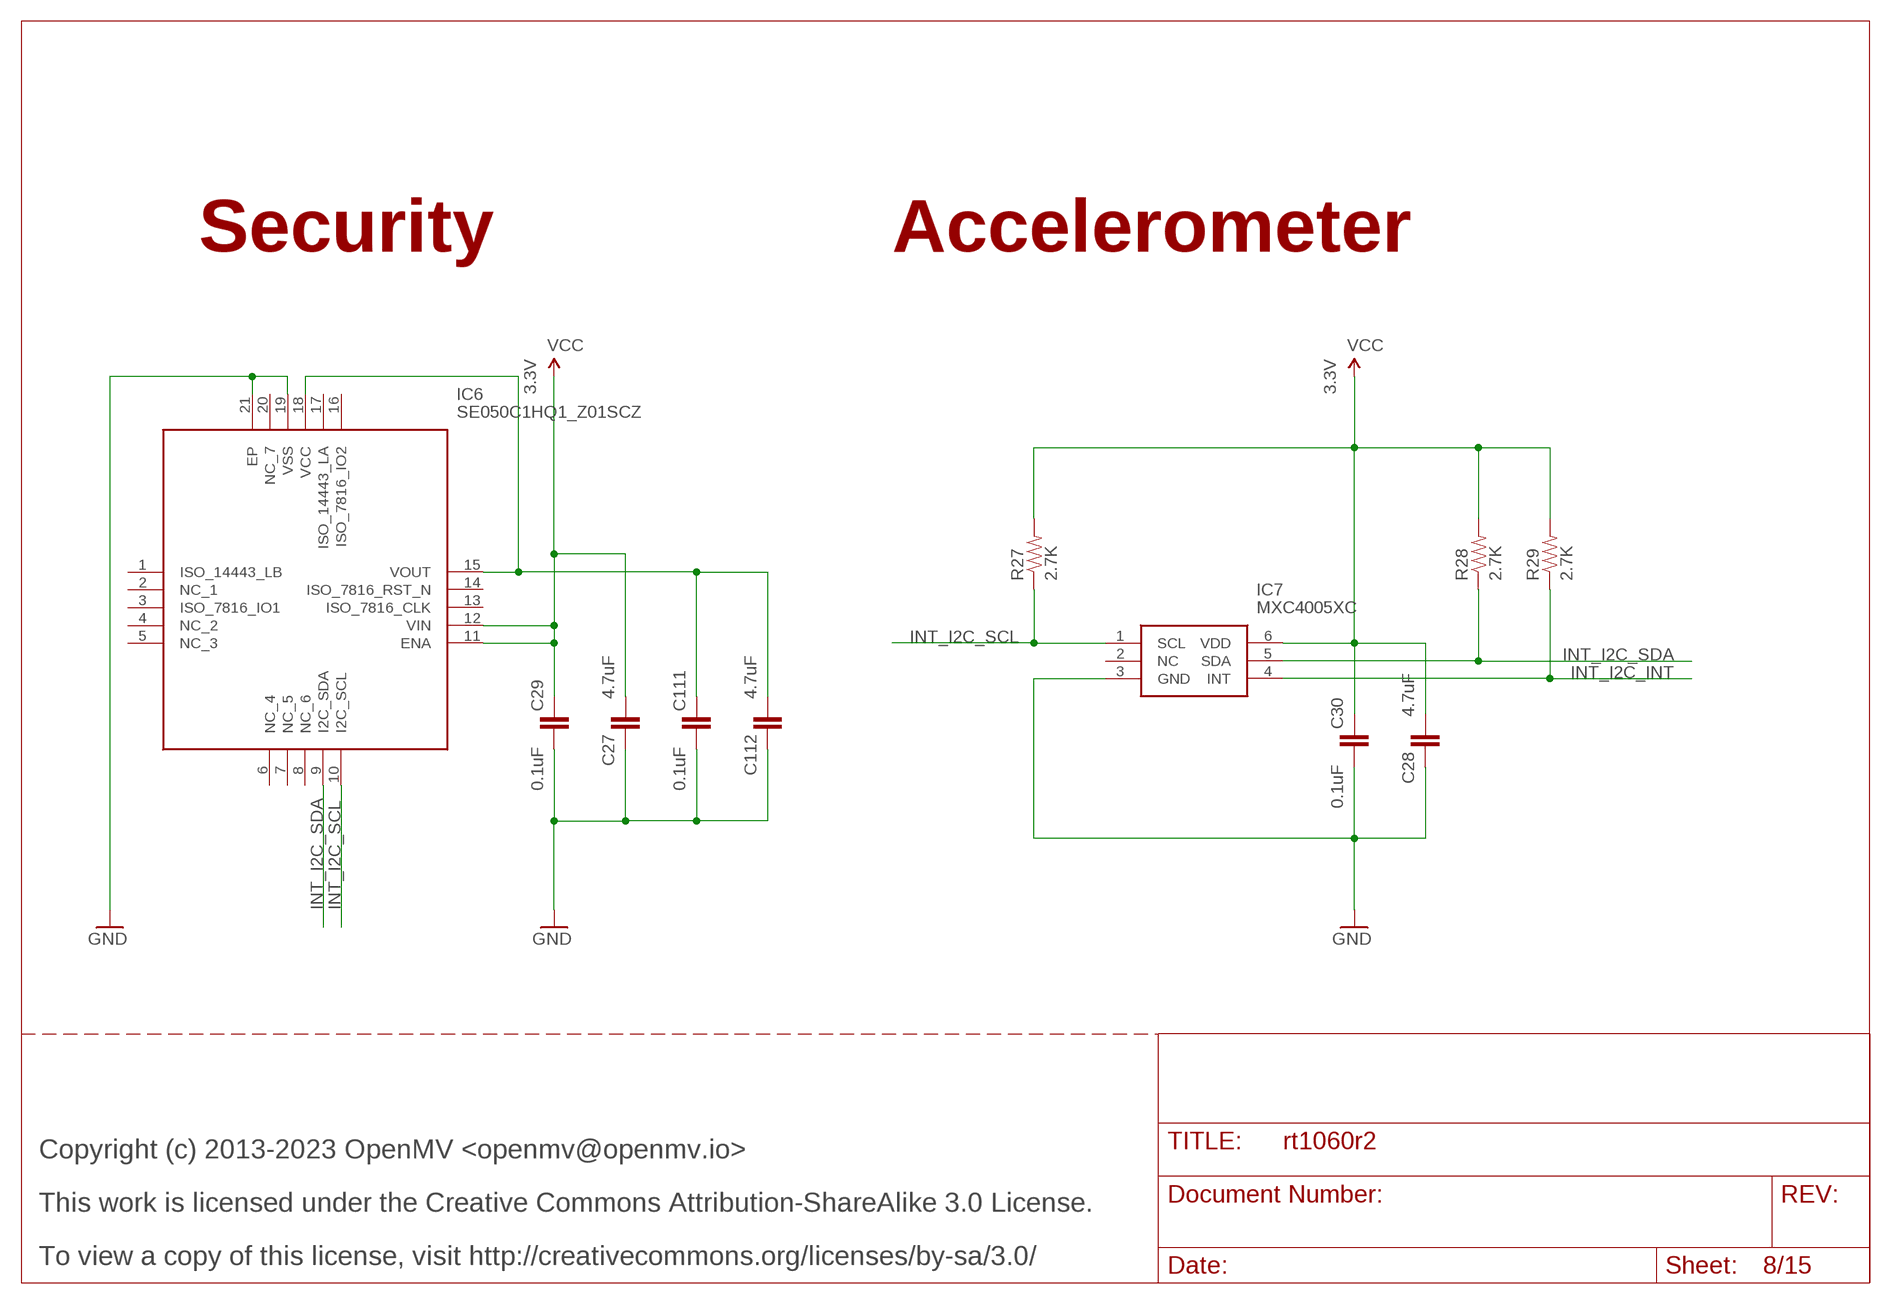
[diagram p7: schematic, sheet 8]

### Parts
C27  4.7uF  CAP_0402  [0402]
C28  4.7uF  CAP_0402  [0402]
C29  0.1uF  CAP_0402  [0402]
C30  0.1uF  CAP_0402  [0402]
C111  0.1uF  CAP_0402  [0402]
C112  4.7uF  CAP_0402  [0402]
IC6  SE050C1HQ1_Z01SCZ  [QFN40P300X300X33-21N]
IC7  MXC4005XC  [MXC4005XC]
R27  2.7K  RES_0402  [0402]
R28  2.7K  RES_0402  [0402]
R29  2.7K  RES_0402  [0402]

### Nets
C_VOUT: C111.1 C112.2 IC6.15(VOUT) IC6.18(VCC)
GND [gnd]: C27.1 C28.1 C29.2 C30.2 C111.2 C112.1 IC6.19(VSS) IC6.21(EP) IC7.3(GND) ; also sheet 1,2,3,4,5,6,7,9,10,11,12,13,14,15
INT_I2C_INT: IC7.4(INT) R29.1 ; also sheet 15
INT_I2C_SCL [i2c]: IC6.10(I2C_SCL) IC7.1(SCL) R27.1 ; also sheet 15
INT_I2C_SDA [i2c]: IC6.9(I2C_SDA) IC7.5(SDA) R28.1 ; also sheet 15
VCC: C27.2 C28.2 C29.1 C30.1 IC6.11(ENA) IC6.12(VIN) IC7.6(VDD) R27.2 R28.2 R29.2 ; also sheet 2,3,5,6,7,9,10,11,12,13,14,15
Unconnected: IC6.1(ISO_14443_LB) IC6.2(NC_1) IC6.3(ISO_7816_IO1) IC6.4(NC_2) IC6.5(NC_3) IC6.6(NC_4) IC6.7(NC_5) IC6.8(NC_6) IC6.13(ISO_7816_CLK) IC6.14(ISO_7816_RST_N) IC6.16(ISO_7816_IO2) IC6.17(ISO_14443_LA) IC6.20(NC_7) IC7.2(NC)

### Notes on the sheet
- Security | Accelerometer
- 3.3V | 3.3V
- Copyright (c) 2013-2023 OpenMV <openmv@openmv.io>
- This work is licensed under the Creative Commons Attribution-ShareAlike 3.0 License.
- To view a copy of this license, visit http://creativecommons.org/licenses/by-sa/3.0/

## Sheet 9 of 15
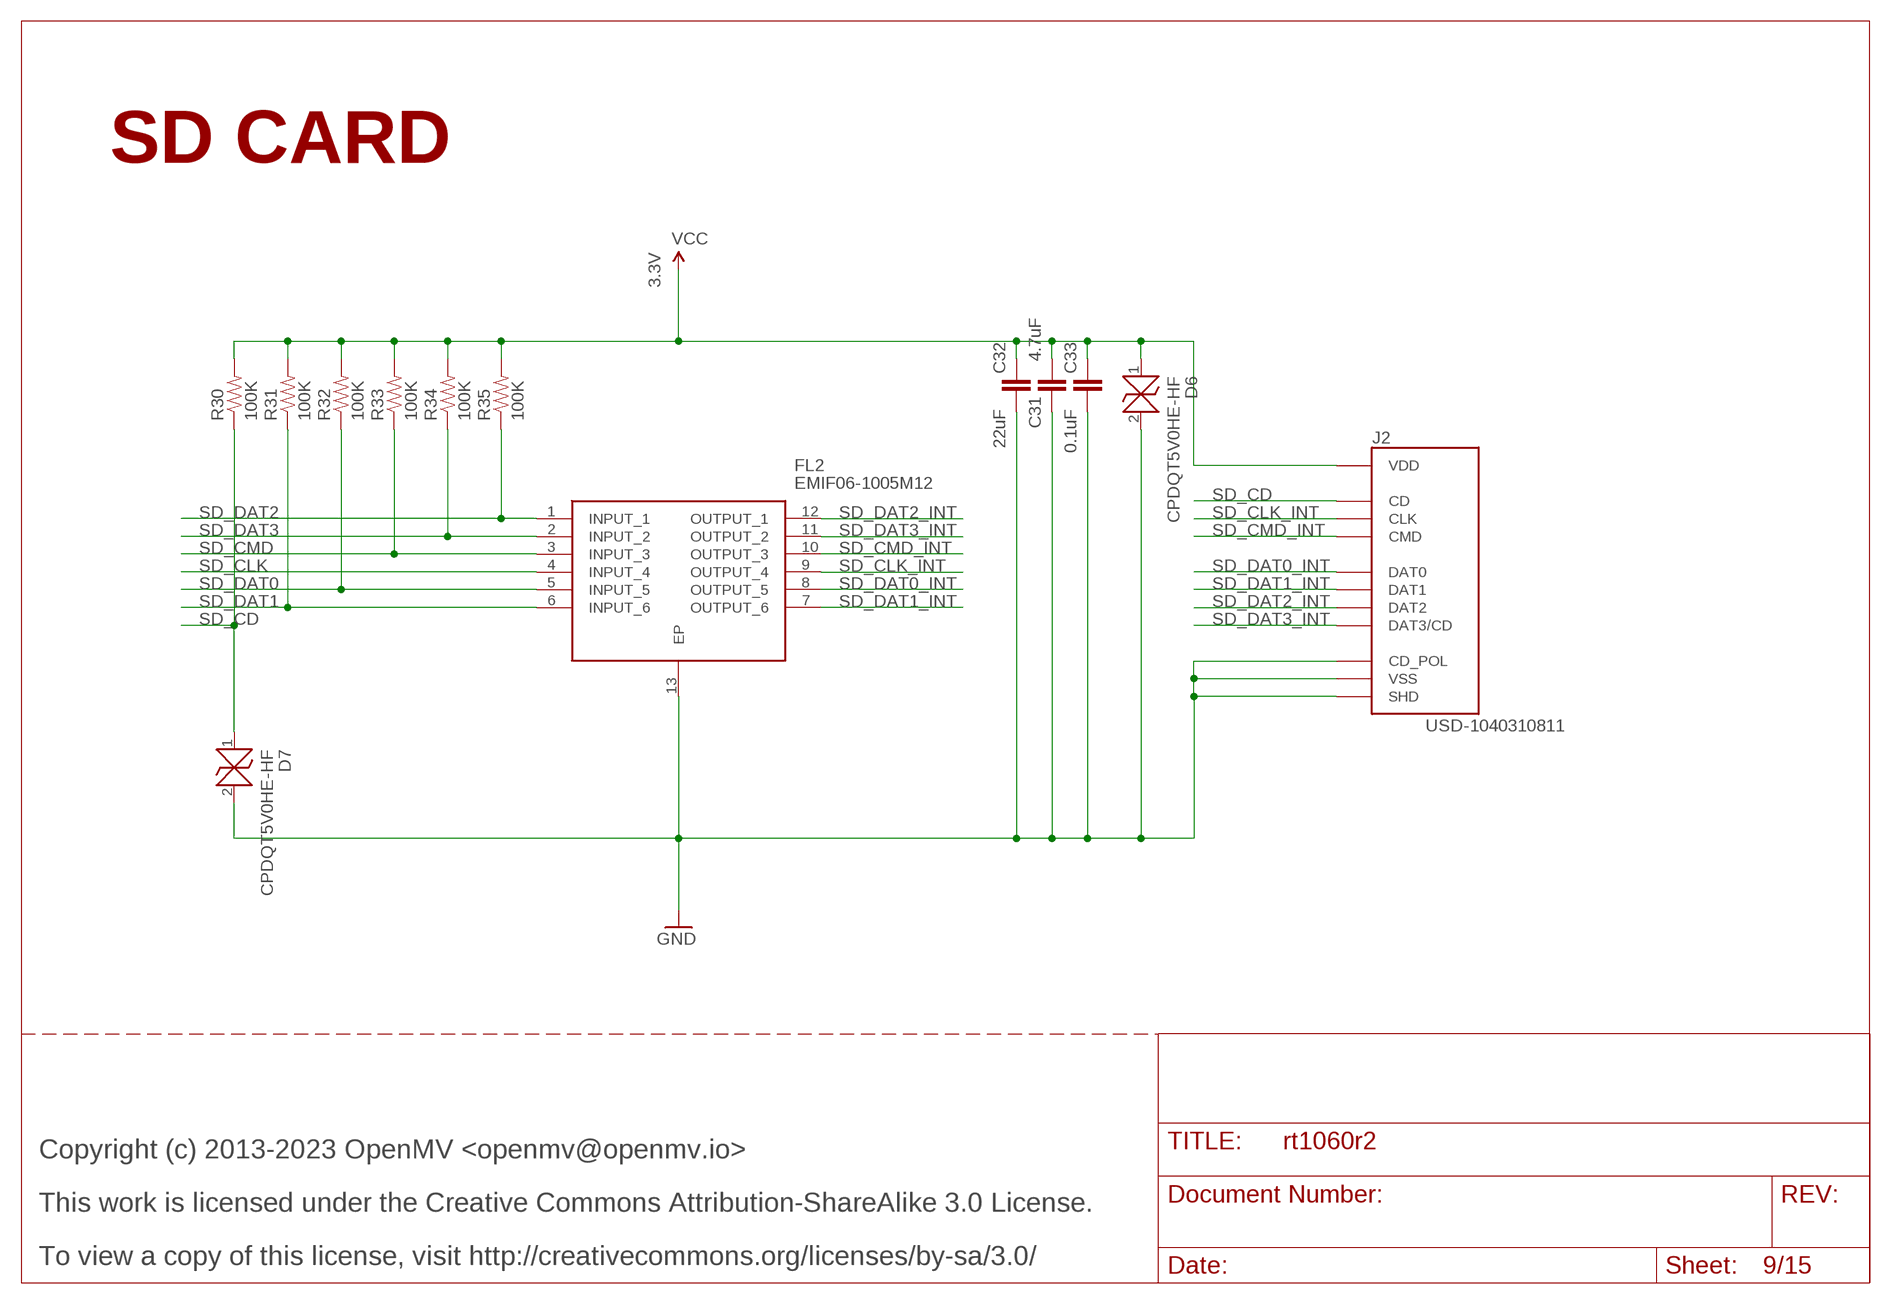
[diagram p8: schematic, sheet 9]

### Parts
C31  4.7uF  CAP_0402  [0402]
C32  22uF  22UF-0805-6.3V-20%  [0805]
C33  0.1uF  CAP_0402  [0402]
D6  CPDQT5V0HE-HF  [CPDQT5V0HEHF]
D7  CPDQT5V0HE-HF  [CPDQT5V0HEHF]
FL2  EMIF06-1005M12  [SON40P150X250X65-13N]
J2  USD-1040310811  [1040310811]
R30  100K  RES_0402  [0402]
R31  100K  RES_0402  [0402]
R32  100K  RES_0402  [0402]
R33  100K  RES_0402  [0402]
R34  100K  RES_0402  [0402]
R35  100K  RES_0402  [0402]

### Nets
GND [gnd]: C31.1 C32.2 C33.2 D6.2 D7.2 FL2.13(EP) J2.CD$2(CD_POL) J2.G$1(SHD) J2.G$2(SHD) J2.G$3(SHD) J2.G$4(SHD) J2.P$6(VSS) ; also sheet 1,2,3,4,5,6,7,8,10,11,12,13,14,15
SD_CD: D7.1 J2.CD$1(CD) R30.1 ; also sheet 15
SD_CLK [sdcard]: FL2.4(INPUT_4) ; also sheet 15
SD_CLK_INT [sdcard]: FL2.9(OUTPUT_4) J2.P$5(CLK)
SD_CMD [sdcard]: FL2.3(INPUT_3) R33.1 ; also sheet 15
SD_CMD_INT [sdcard]: FL2.10(OUTPUT_3) J2.P$3(CMD)
SD_DAT0 [sdcard]: FL2.5(INPUT_5) R32.1 ; also sheet 15
SD_DAT0_INT: FL2.8(OUTPUT_5) J2.P$7(DAT0)
SD_DAT1 [sdcard]: FL2.6(INPUT_6) R31.1 ; also sheet 15
SD_DAT1_INT: FL2.7(OUTPUT_6) J2.P$8(DAT1)
SD_DAT2 [sdcard]: FL2.1(INPUT_1) R35.1 ; also sheet 15
SD_DAT2_INT [sdcard]: FL2.12(OUTPUT_1) J2.P$1(DAT2)
SD_DAT3 [sdcard]: FL2.2(INPUT_2) R34.1 ; also sheet 15
SD_DAT3_INT [sdcard]: FL2.11(OUTPUT_2) J2.P$2(DAT3/CD)
VCC: C31.2 C32.1 C33.1 D6.1 J2.P$4(VDD) R30.2 R31.2 R32.2 R33.2 R34.2 R35.2 ; also sheet 2,3,5,6,7,8,10,11,12,13,14,15

### Notes on the sheet
- SD CARD
- 3.3V
- Copyright (c) 2013-2023 OpenMV <openmv@openmv.io>
- This work is licensed under the Creative Commons Attribution-ShareAlike 3.0 License.
- To view a copy of this license, visit http://creativecommons.org/licenses/by-sa/3.0/

## Sheet 10 of 15
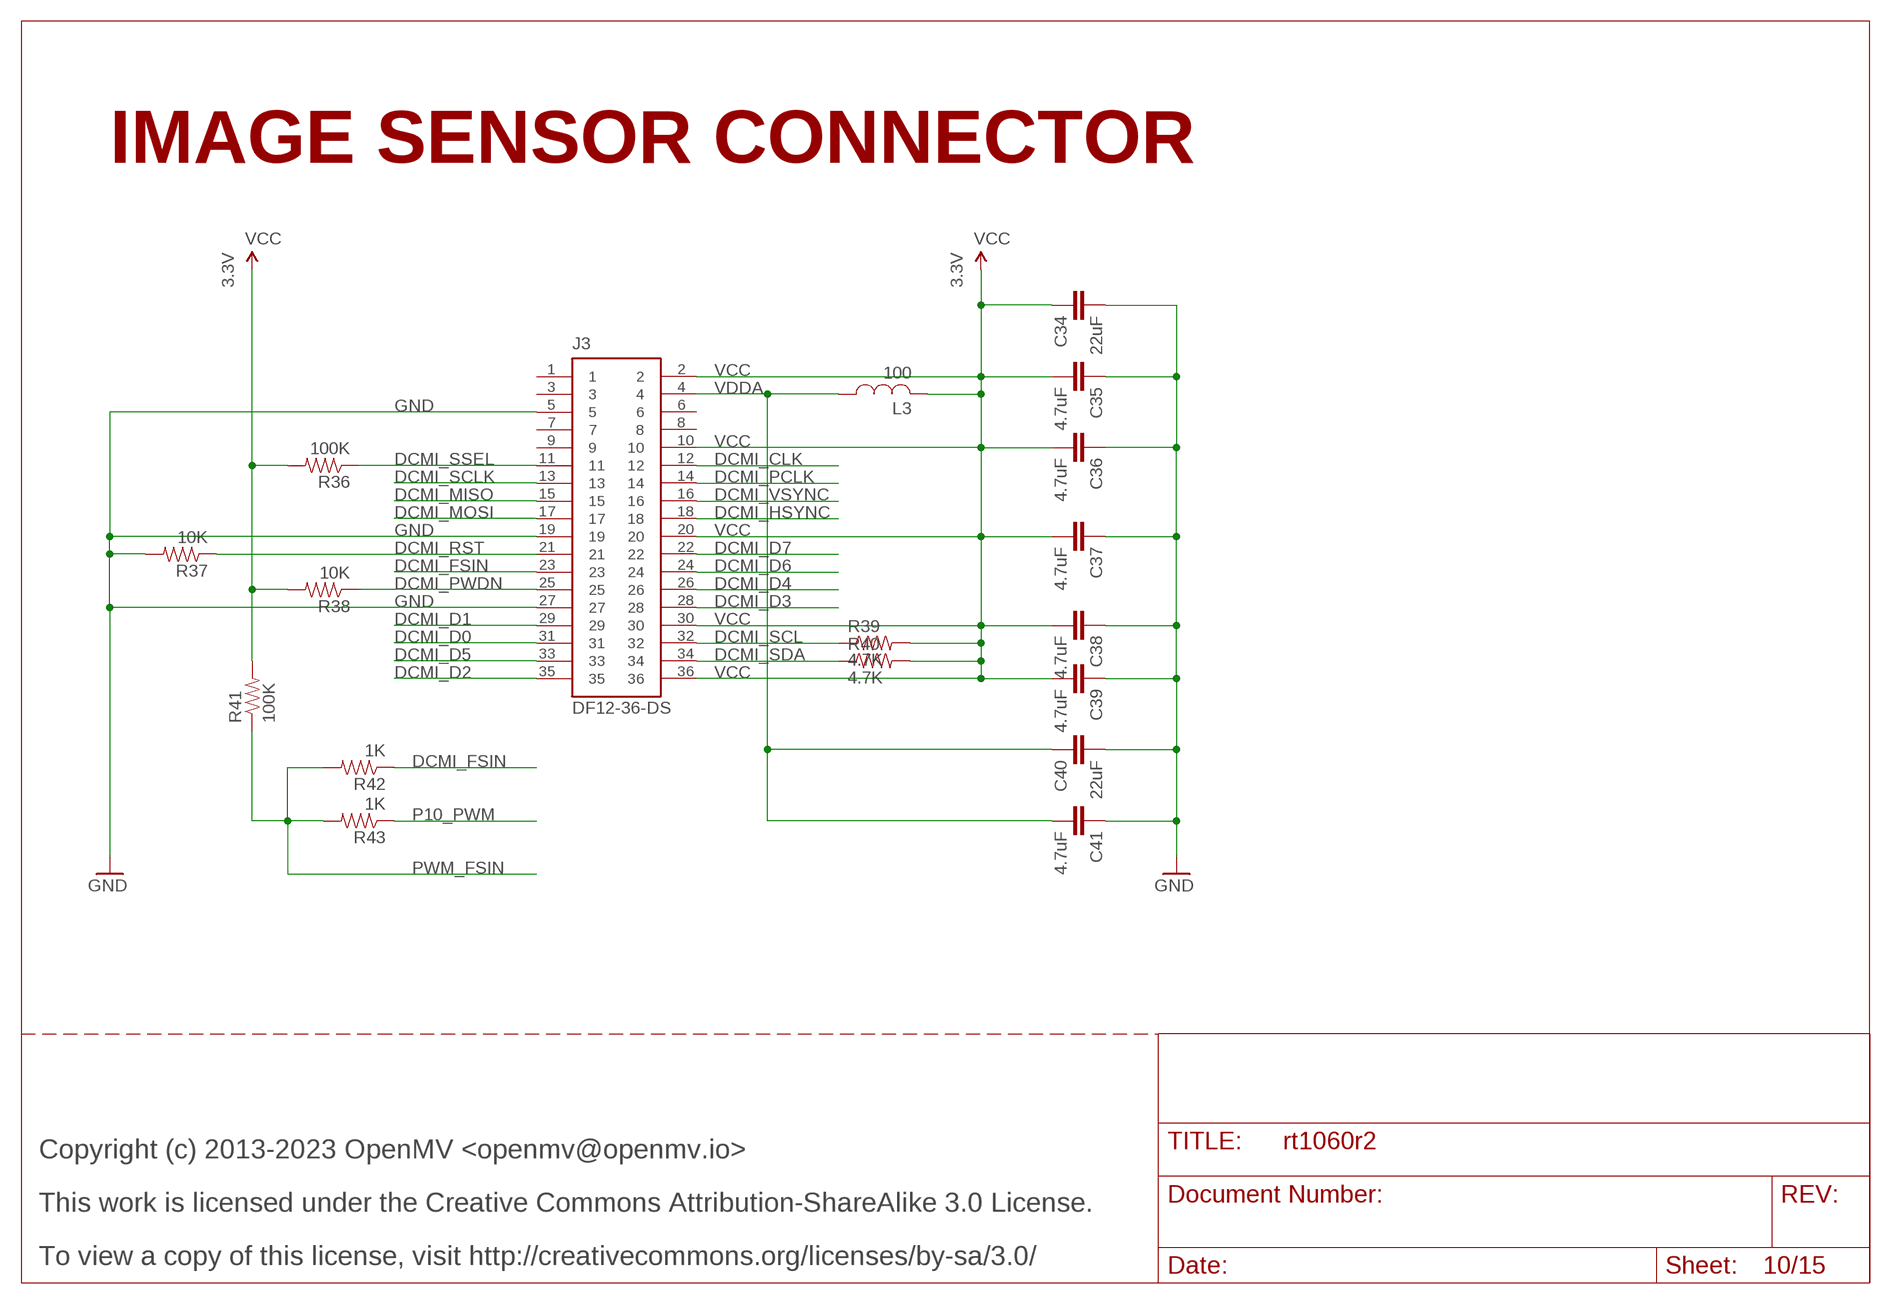
[diagram p9: schematic, sheet 10]

### Parts
C34  22uF  22UF-0805-6.3V-20%  [0805]
C35  4.7uF  CAP_0402  [0402]
C36  4.7uF  CAP_0402  [0402]
C37  4.7uF  CAP_0402  [0402]
C38  4.7uF  CAP_0402  [0402]
C39  4.7uF  CAP_0402  [0402]
C40  22uF  22UF-0805-6.3V-20%  [0805]
C41  4.7uF  CAP_0402  [0402]
J3  DF12-36-DS  [DF12-36-DS]
L3  100  INDUCTOR_0402  [0402]
R36  100K  RES_0402  [0402]
R37  10K  RES_0402  [0402]
R38  10K  RES_0402  [0402]
R39  4.7K  RES_0402  [0402]
R40  4.7K  RES_0402  [0402]
R41  100K  RES_0402  [0402]
R42  1K  RES_0402  [0402]
R43  1K  RES_0402  [0402]

### Nets
DCMI_CLK: J3.12 ; also sheet 15
DCMI_D0 [dcmi]: J3.31 ; also sheet 15
DCMI_D1 [dcmi]: J3.29 ; also sheet 15
DCMI_D2 [dcmi]: J3.35 ; also sheet 15
DCMI_D3 [dcmi]: J3.28 ; also sheet 15
DCMI_D4 [dcmi]: J3.26 ; also sheet 15
DCMI_D5 [dcmi]: J3.33 ; also sheet 15
DCMI_D6 [dcmi]: J3.24 ; also sheet 15
DCMI_D7 [dcmi]: J3.22 ; also sheet 11,15
DCMI_FSIN: J3.23 R42.1
DCMI_HSYNC [dcmi]: J3.18 ; also sheet 15
DCMI_MISO [spi]: J3.15 ; also sheet 15
DCMI_MOSI [spi]: J3.17 ; also sheet 15
DCMI_PCLK [dcmi]: J3.14 ; also sheet 15
DCMI_PWDN: J3.25 R38.1 ; also sheet 15
DCMI_RST: J3.21 R37.1 ; also sheet 15
DCMI_SCL [i2c]: J3.32 R39.1 ; also sheet 15
DCMI_SCLK [spi]: J3.13 ; also sheet 15
DCMI_SDA [i2c]: J3.34 R40.1 ; also sheet 15
DCMI_SSEL [spi]: J3.11 R36.1 ; also sheet 15
DCMI_VSYNC [dcmi]: J3.16 ; also sheet 15
GND [gnd]: C34.2 C35.1 C36.1 C37.1 C38.1 C39.1 C40.2 C41.1 J3.5 J3.19 J3.27 R37.2 ; also sheet 1,2,3,4,5,6,7,8,9,11,12,13,14,15
P10_PWM: R43.1 ; also sheet 11
PWM_FSIN: R41.1 R42.2 R43.2 ; also sheet 15
VCC: C34.1 C35.2 C36.2 C37.2 C38.2 C39.2 J3.2 J3.10 J3.20 J3.30 J3.36 L3.2 R36.2 R38.2 R39.2 R40.2 R41.2 ; also sheet 2,3,5,6,7,8,9,11,12,13,14,15
VDDA: C40.1 C41.2 J3.4 L3.1
Unconnected: J3.1 J3.3 J3.6 J3.7 J3.8 J3.9

### Notes on the sheet
- IMAGE SENSOR CONNECTOR
- 3.3V | 3.3V
- Copyright (c) 2013-2023 OpenMV <openmv@openmv.io>
- This work is licensed under the Creative Commons Attribution-ShareAlike 3.0 License.
- To view a copy of this license, visit http://creativecommons.org/licenses/by-sa/3.0/

## Sheet 11 of 15
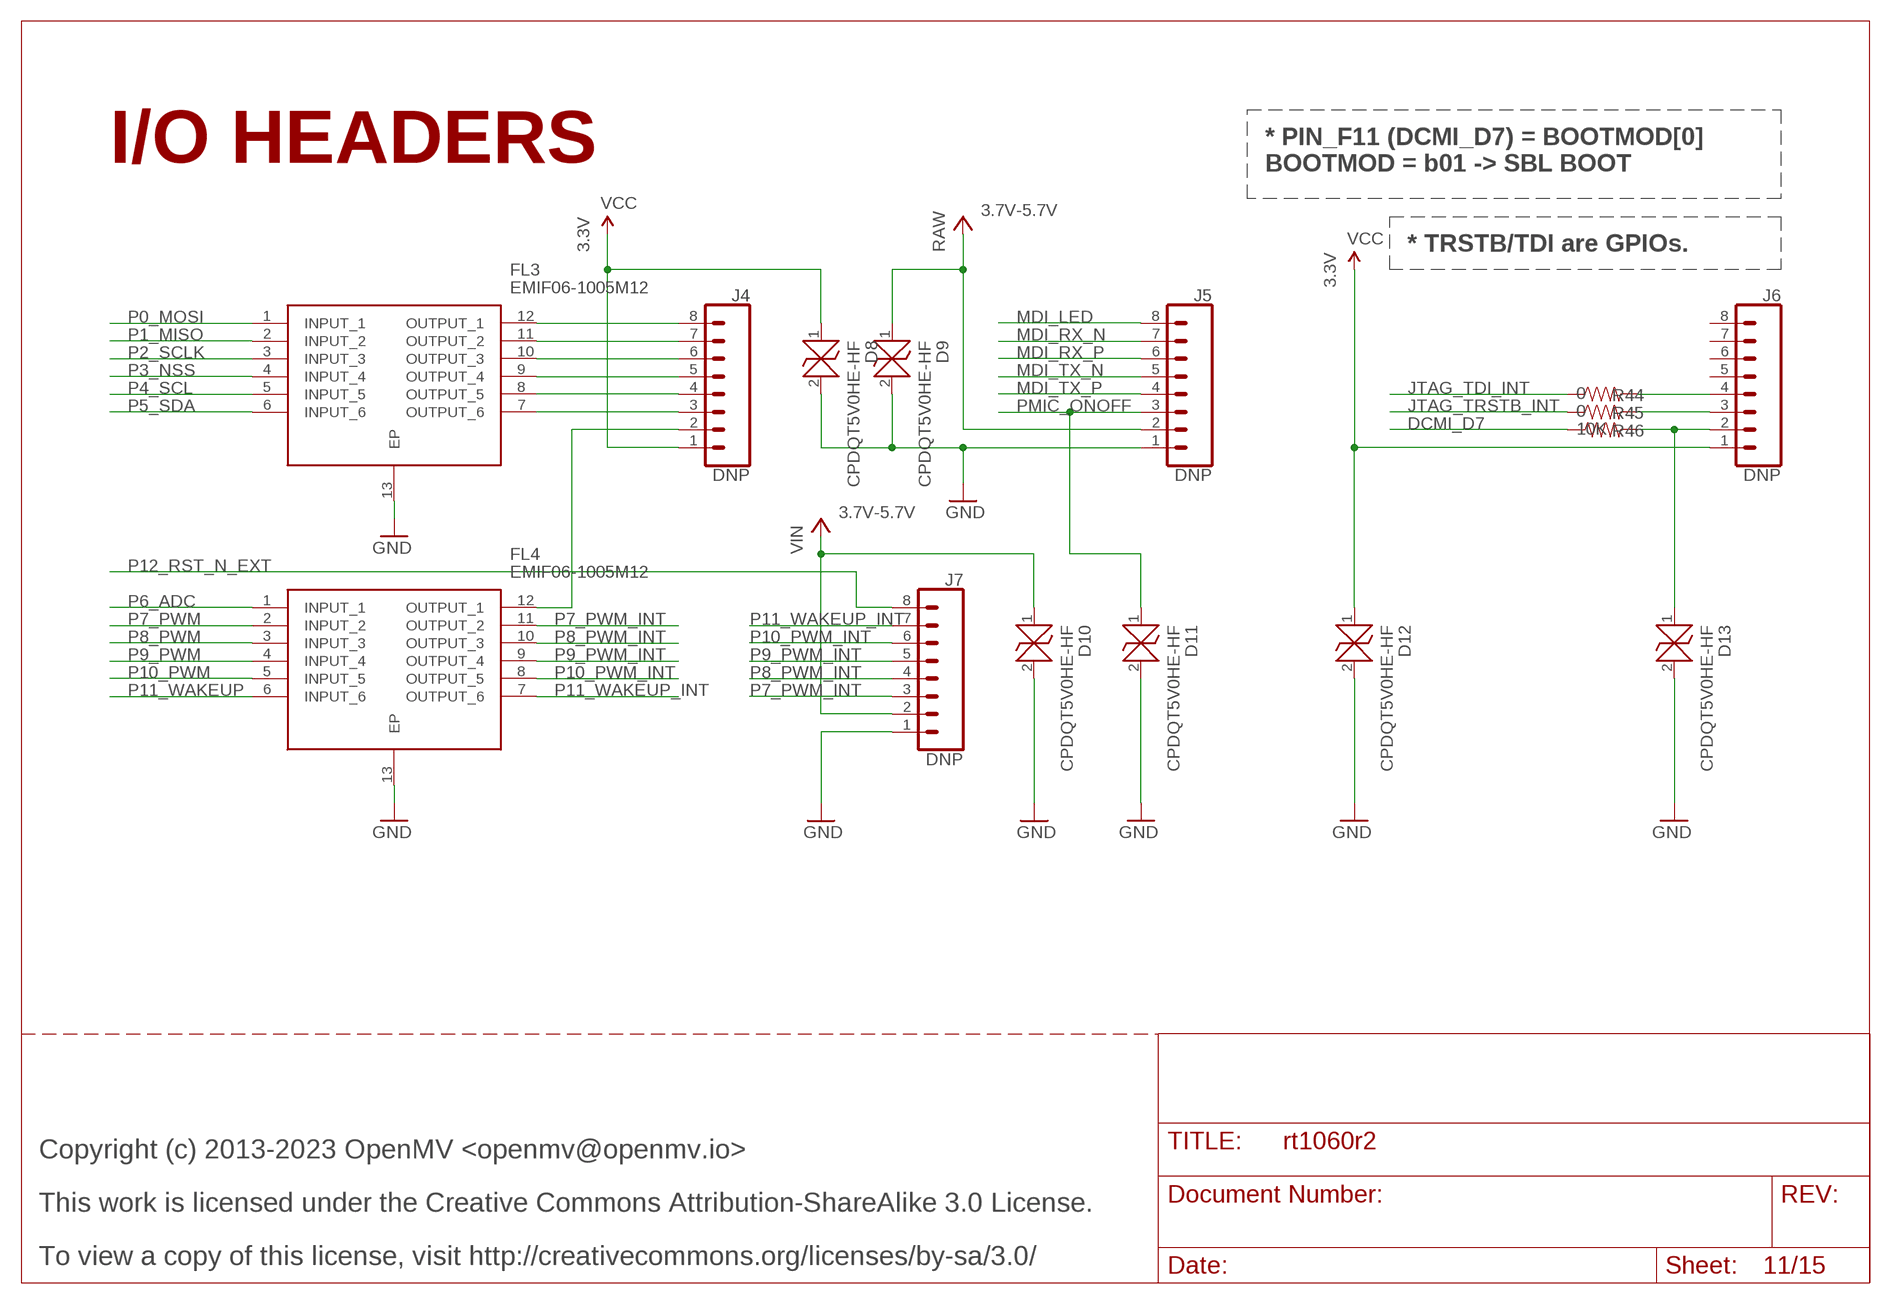
[diagram p10: schematic, sheet 11]

### Parts
D8  CPDQT5V0HE-HF  [CPDQT5V0HEHF]
D9  CPDQT5V0HE-HF  [CPDQT5V0HEHF]
D10  CPDQT5V0HE-HF  [CPDQT5V0HEHF]
D11  CPDQT5V0HE-HF  [CPDQT5V0HEHF]
D12  CPDQT5V0HE-HF  [CPDQT5V0HEHF]
D13  CPDQT5V0HE-HF  [CPDQT5V0HEHF]
FL3  EMIF06-1005M12  [SON40P150X250X65-13N]
FL4  EMIF06-1005M12  [SON40P150X250X65-13N]
J4  DNP  CONN_08"  [1X08]
J5  DNP  CONN_08"  [1X08]
J6  DNP  CONN_08"  [1X08]
J7  DNP  CONN_08"  [1X08]
R44  0  RES_0402  [0402]
R45  0  RES_0402  [0402]
R46  10K  RES_0402  [0402]

### Nets
DCMI_D7 [dcmi]: R46.1 ; also sheet 10,15
GND [gnd]: D8.2 D9.2 D10.2 D11.2 D12.2 D13.2 FL3.13(EP) FL4.13(EP) J5.1 J7.1 ; also sheet 1,2,3,4,5,6,7,8,9,10,12,13,14,15
JTAG_TDI_INT [jtag]: R44.1 ; also sheet 12
JTAG_TRSTB_INT [jtag]: R45.1 ; also sheet 12
MDI_LED: J5.8 ; also sheet 13
MDI_RX_N [mdi]: J5.7 ; also sheet 13
MDI_RX_P [mdi]: J5.6 ; also sheet 13
MDI_TX_N [mdi]: J5.5 ; also sheet 13
MDI_TX_P [mdi]: J5.4 ; also sheet 13
P0_MOSI [spi]: FL3.1(INPUT_1) ; also sheet 15
P0_MOSI_INT [spi]: FL3.12(OUTPUT_1) J4.8
P1_MISO [spi]: FL3.2(INPUT_2) ; also sheet 15
P1_MISO_INT [spi]: FL3.11(OUTPUT_2) J4.7
P2_SCLK [spi]: FL3.3(INPUT_3) ; also sheet 15
P2_SCLK_INT [spi]: FL3.10(OUTPUT_3) J4.6
P3_NSS [spi]: FL3.4(INPUT_4) ; also sheet 15
P3_NSS_INT [spi]: FL3.9(OUTPUT_4) J4.5
P4_SCL [i2c]: FL3.5(INPUT_5) ; also sheet 15
P4_SCL_INT [i2c]: FL3.8(OUTPUT_5) J4.4
P5_SDA [i2c]: FL3.6(INPUT_6) ; also sheet 15
P5_SDA_INT [i2c]: FL3.7(OUTPUT_6) J4.3
P6_ADC: FL4.1(INPUT_1) ; also sheet 15
P6_ADC_INT: FL4.12(OUTPUT_1) J4.2
P7_PWM: FL4.2(INPUT_2) ; also sheet 15
P7_PWM_INT: FL4.11(OUTPUT_2) J7.3
P8_PWM: FL4.3(INPUT_3) ; also sheet 15
P8_PWM_INT: FL4.10(OUTPUT_3) J7.4
P9_PWM: FL4.4(INPUT_4) ; also sheet 15
P9_PWM_INT: FL4.9(OUTPUT_4) J7.5
P10_PWM: FL4.5(INPUT_5) ; also sheet 10
P10_PWM_INT: FL4.8(OUTPUT_5) J7.6
P11_WAKEUP: FL4.6(INPUT_6) ; also sheet 4
P11_WAKEUP_INT: FL4.7(OUTPUT_6) J7.7
P12_RST_N_EXT: J7.8 ; also sheet 12
P13 [jtag]: J6.3 R45.2
P14 [jtag]: J6.4 R44.2
PMIC_ONOFF: D11.1 J5.3 ; also sheet 4
RAW: D9.1 J5.2 ; also sheet 3,4,5
SBL: D13.1 J6.2 R46.2
VCC: D8.1 D12.1 J4.1 J6.1 ; also sheet 2,3,5,6,7,8,9,10,12,13,14,15
VIN [power]: D10.1 J7.2 ; also sheet 2
Unconnected: J6.5 J6.6 J6.7 J6.8

### Notes on the sheet
- I/O HEADERS
- * PIN_F11 (DCMI_D7) = BOOTMOD[0]
  BOOTMOD = b01 -> SBL BOOT
- 3.7V-5.7V
- 3.3V | * TRSTB/TDI are GPIOs.
- 3.3V
- 3.7V-5.7V
- Copyright (c) 2013-2023 OpenMV <openmv@openmv.io>
- This work is licensed under the Creative Commons Attribution-ShareAlike 3.0 License.
- To view a copy of this license, visit http://creativecommons.org/licenses/by-sa/3.0/

## Sheet 12 of 15
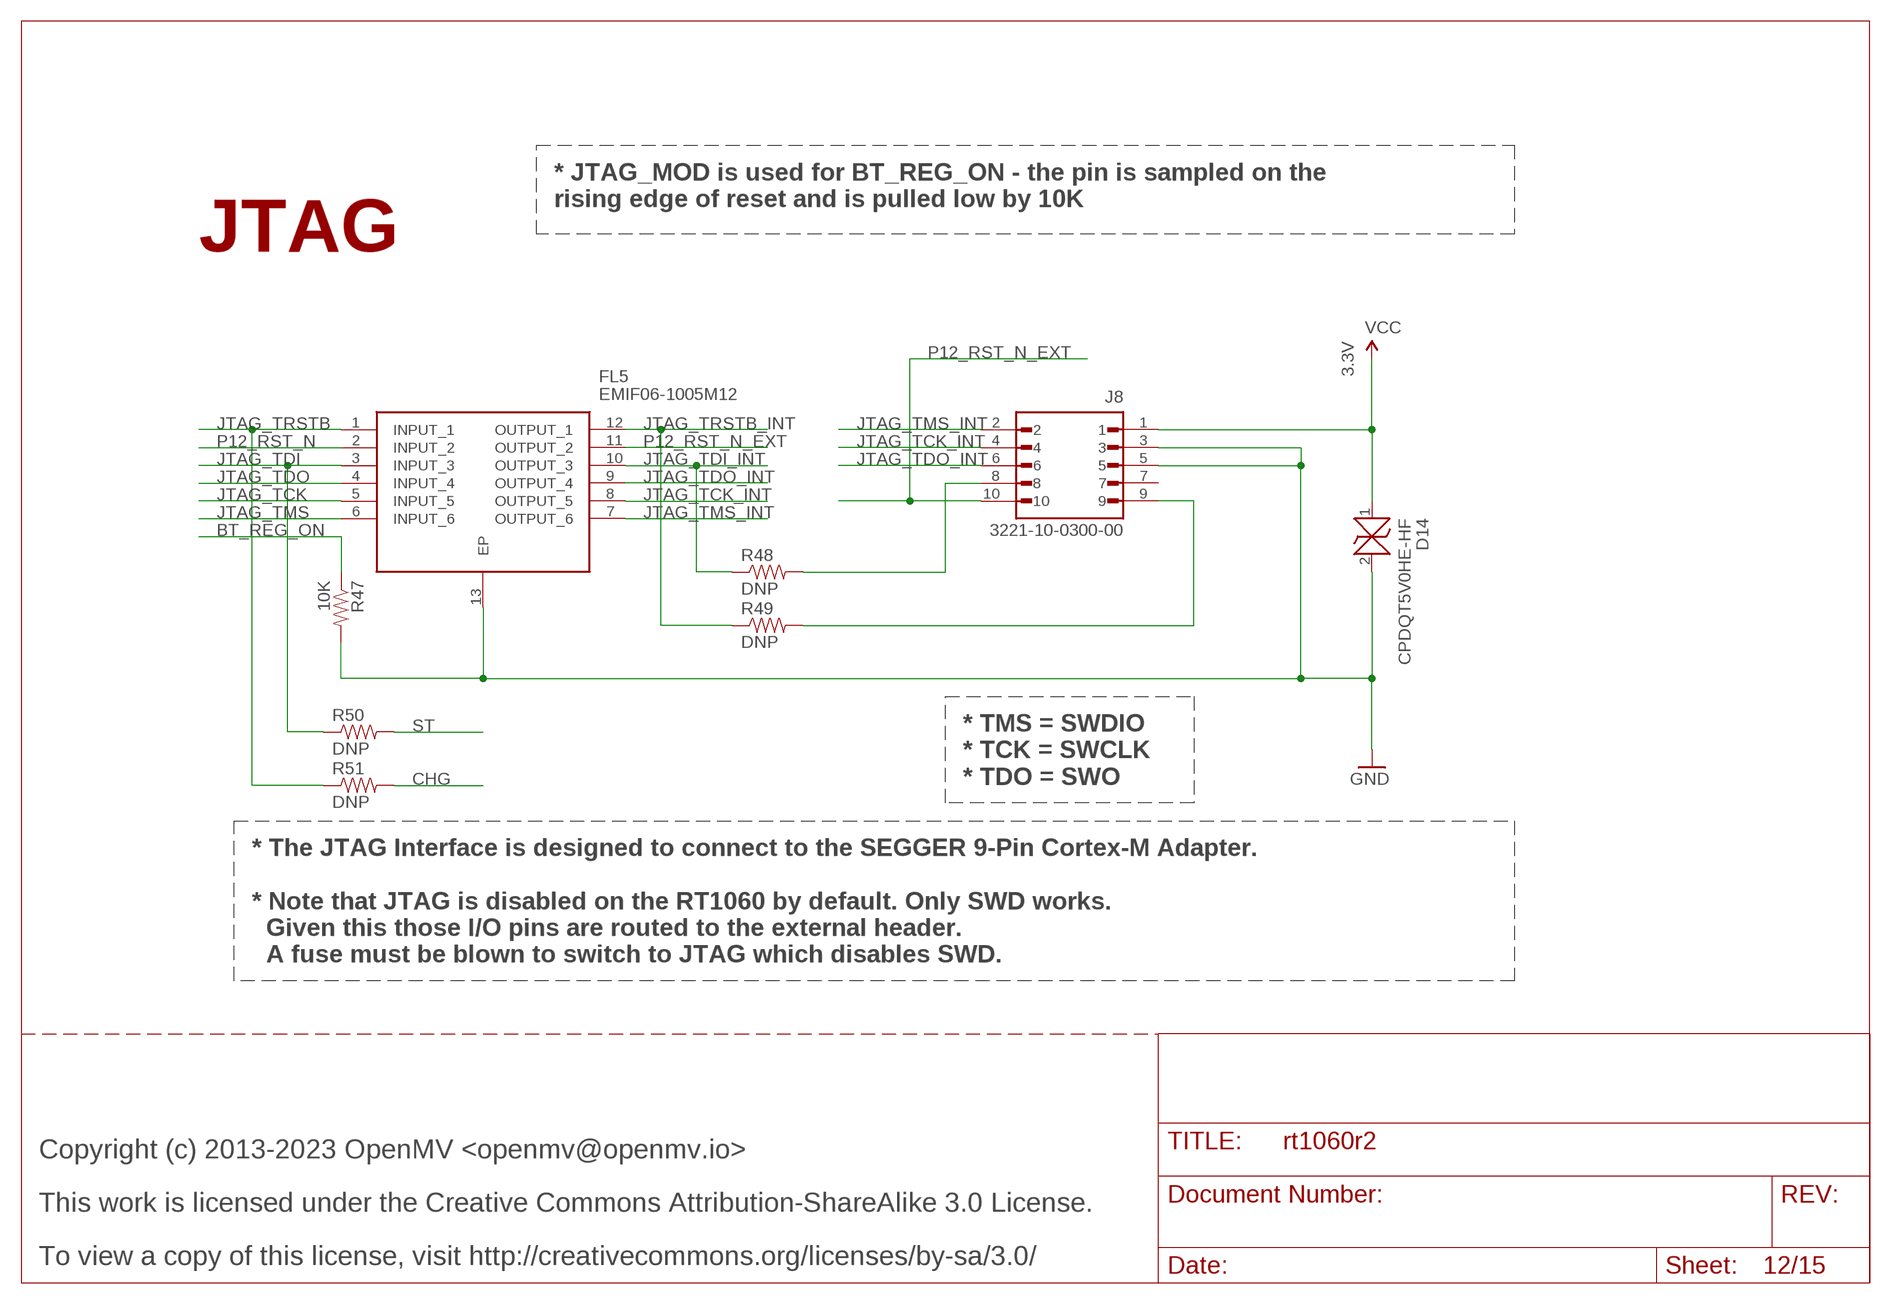
[diagram p11: schematic, sheet 12]

### Parts
D14  CPDQT5V0HE-HF  [CPDQT5V0HEHF]
FL5  EMIF06-1005M12  [SON40P150X250X65-13N]
J8  3221-10-0300-00  [CNC_3221-10-0300-00]
R47  10K  RES_0402  [0402]
R48  DNP  RES_0402  [0402]
R49  DNP  RES_0402  [0402]
R50  DNP  RES_0402  [0402]
R51  DNP  RES_0402  [0402]

### Nets
BT_REG_ON: R47.1 ; also sheet 14,15
CHG: R51.2 ; also sheet 3
GND [gnd]: D14.2 FL5.13(EP) J8.3 J8.5 R47.2 ; also sheet 1,2,3,4,5,6,7,8,9,10,11,13,14,15
JTAG_TCK [jtag]: FL5.5(INPUT_5) ; also sheet 15
JTAG_TCK_INT [jtag]: FL5.8(OUTPUT_5) J8.4
JTAG_TDI [jtag]: FL5.3(INPUT_3) R50.1 ; also sheet 15
JTAG_TDI_INT [jtag]: FL5.10(OUTPUT_3) R48.1 ; also sheet 11
JTAG_TDI_INT_UNUSED: J8.8 R48.2
JTAG_TDO [jtag]: FL5.4(INPUT_4) ; also sheet 15
JTAG_TDO_INT [jtag]: FL5.9(OUTPUT_4) J8.6
JTAG_TMS [jtag]: FL5.6(INPUT_6) ; also sheet 15
JTAG_TMS_INT [jtag]: FL5.7(OUTPUT_6) J8.2
JTAG_TRSTB [jtag]: FL5.1(INPUT_1) R51.1 ; also sheet 15
JTAG_TRSTB_INT [jtag]: FL5.12(OUTPUT_1) R49.1 ; also sheet 11
JTAG_TRSTB_INT_UNUSED: J8.9 R49.2
P12_RST_N: FL5.2(INPUT_2) ; also sheet 15
P12_RST_N_EXT: FL5.11(OUTPUT_2) J8.10 ; also sheet 11
ST: R50.2 ; also sheet 2
VCC: D14.1 J8.1 ; also sheet 2,3,5,6,7,8,9,10,11,13,14,15
Unconnected: J8.7

### Notes on the sheet
- * JTAG_MOD is used for BT_REG_ON - the pin is sampled on the
  rising edge of reset and is pulled low by 10K
- JTAG
- 3.3V
- * TMS = SWDIO
  * TCK = SWCLK
  * TDO = SWO
- * The JTAG Interface is designed to connect to the SEGGER 9-Pin Cortex-M Adapter.
  
  * Note that JTAG is disabled on the RT1060 by default. Only SWD works.
    Given this those I/O pins are routed to the external header.
    A fuse must be blown to switch to JTAG which disables SWD.
- Copyright (c) 2013-2023 OpenMV <openmv@openmv.io>
- This work is licensed under the Creative Commons Attribution-ShareAlike 3.0 License.
- To view a copy of this license, visit http://creativecommons.org/licenses/by-sa/3.0/

## Sheet 13 of 15
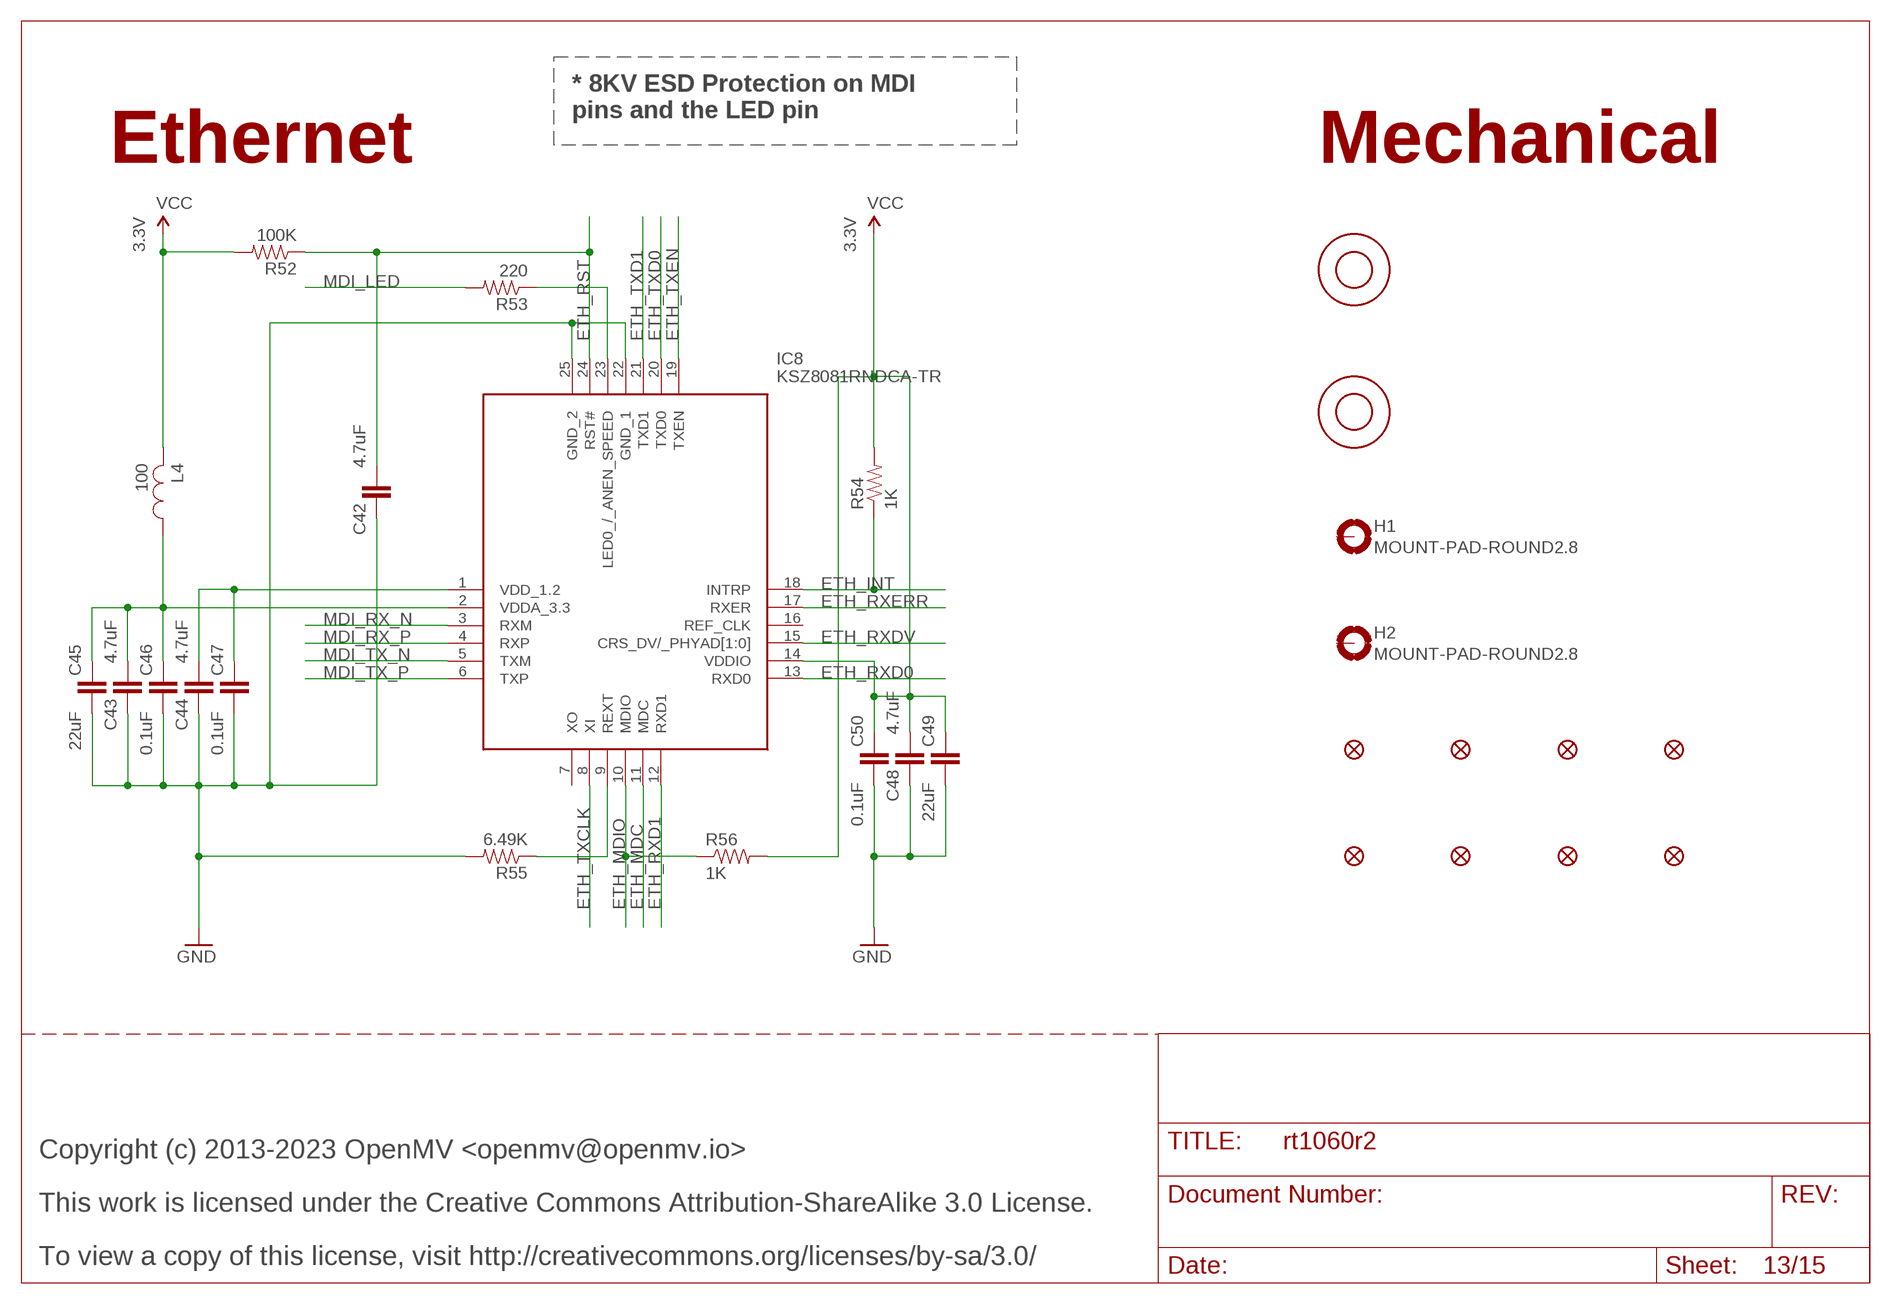
[diagram p12: schematic, sheet 13]

### Parts
C42  4.7uF  CAP_0402  [0402]
C43  4.7uF  CAP_0402  [0402]
C44  4.7uF  CAP_0402  [0402]
C45  22uF  22UF-0805-6.3V-20%  [0805]
C46  0.1uF  CAP_0402  [0402]
C47  0.1uF  CAP_0402  [0402]
C48  4.7uF  CAP_0402  [0402]
C49  22uF  22UF-0805-6.3V-20%  [0805]
C50  0.1uF  CAP_0402  [0402]
FD1  FIDUCIAL1X2  [FIDUCIAL-1X2]
FD2  FIDUCIAL1X2  [FIDUCIAL-1X2]
FD3  FIDUCIAL1X2  [FIDUCIAL-1X2]
FD4  FIDUCIAL1X2  [FIDUCIAL-1X2]
FD5  FIDUCIAL1X2  [FIDUCIAL-1X2]
FD6  FIDUCIAL1X2  [FIDUCIAL-1X2]
FD7  FIDUCIAL1X2  [FIDUCIAL-1X2]
FD8  FIDUCIAL1X2  [FIDUCIAL-1X2]
H1  MOUNT-PAD-ROUND2.8  [2,8-PAD]
H2  MOUNT-PAD-ROUND2.8  [2,8-PAD]
IC8  KSZ8081RNDCA-TR  [QFN50P400X400X90-25N]
L4  100  INDUCTOR_0402  [0402]
M1  9774030151R  [9774030151R]
M2  9774030151R  [9774030151R]
R52  100K  RES_0402  [0402]
R53  220  RES_0402  [0402]
R54  1K  RES_0402  [0402]
R55  6.49K  RES_0402  [0402]
R56  1K  RES_0402  [0402]

### Nets
ETH_INT: IC8.18(INTRP) R54.1 ; also sheet 15
ETH_LED: IC8.23(LED0_/_ANEN_SPEED) R53.1
ETH_MDC [mdio]: IC8.11(MDC) ; also sheet 15
ETH_MDIO [mdio]: IC8.10(MDIO) R56.1 ; also sheet 15
ETH_RST: C42.2 IC8.24(RST#) R52.1 ; also sheet 15
ETH_RXD0 [eth]: IC8.13(RXD0) ; also sheet 15
ETH_RXD1 [eth]: IC8.12(RXD1) ; also sheet 15
ETH_RXDV [eth]: IC8.15(CRS_DV/_PHYAD[1:0]) ; also sheet 15
ETH_RXERR [eth]: IC8.17(RXER) ; also sheet 15
ETH_TXCLK [eth]: IC8.8(XI) ; also sheet 15
ETH_TXD0 [eth]: IC8.20(TXD0) ; also sheet 15
ETH_TXD1 [eth]: IC8.21(TXD1) ; also sheet 15
ETH_TXEN [eth]: IC8.19(TXEN) ; also sheet 15
ETH_VDD_1.2: C44.2 C47.1 IC8.1(VDD_1.2)
ETH_VDDA_3.3: C43.2 C45.1 C46.1 IC8.2(VDDA_3.3) L4.1
GND [gnd]: C42.1 C43.1 C44.1 C45.2 C46.2 C47.2 C48.1 C49.2 C50.2 IC8.22(GND_1) IC8.25(GND_2) R55.2 ; also sheet 1,2,3,4,5,6,7,8,9,10,11,12,14,15
MDI_LED: R53.2 ; also sheet 11
MDI_RX_N [mdi]: IC8.3(RXM) ; also sheet 11
MDI_RX_P [mdi]: IC8.4(RXP) ; also sheet 11
MDI_TX_N [mdi]: IC8.5(TXM) ; also sheet 11
MDI_TX_P [mdi]: IC8.6(TXP) ; also sheet 11
REXT: IC8.9(REXT) R55.1
VCC: C48.2 C49.1 C50.1 IC8.14(VDDIO) L4.2 R52.2 R54.2 R56.2 ; also sheet 2,3,5,6,7,8,9,10,11,12,14,15
Unconnected: H1.B2,8(MOUNT) H2.B2,8(MOUNT) IC8.7(XO) IC8.16(REF_CLK)

### Notes on the sheet
- * 8KV ESD Protection on MDI
  pins and the LED pin
- Ethernet | Mechanical
- 3.3V | 3.3V
- Copyright (c) 2013-2023 OpenMV <openmv@openmv.io>
- This work is licensed under the Creative Commons Attribution-ShareAlike 3.0 License.
- To view a copy of this license, visit http://creativecommons.org/licenses/by-sa/3.0/

## Sheet 14 of 15
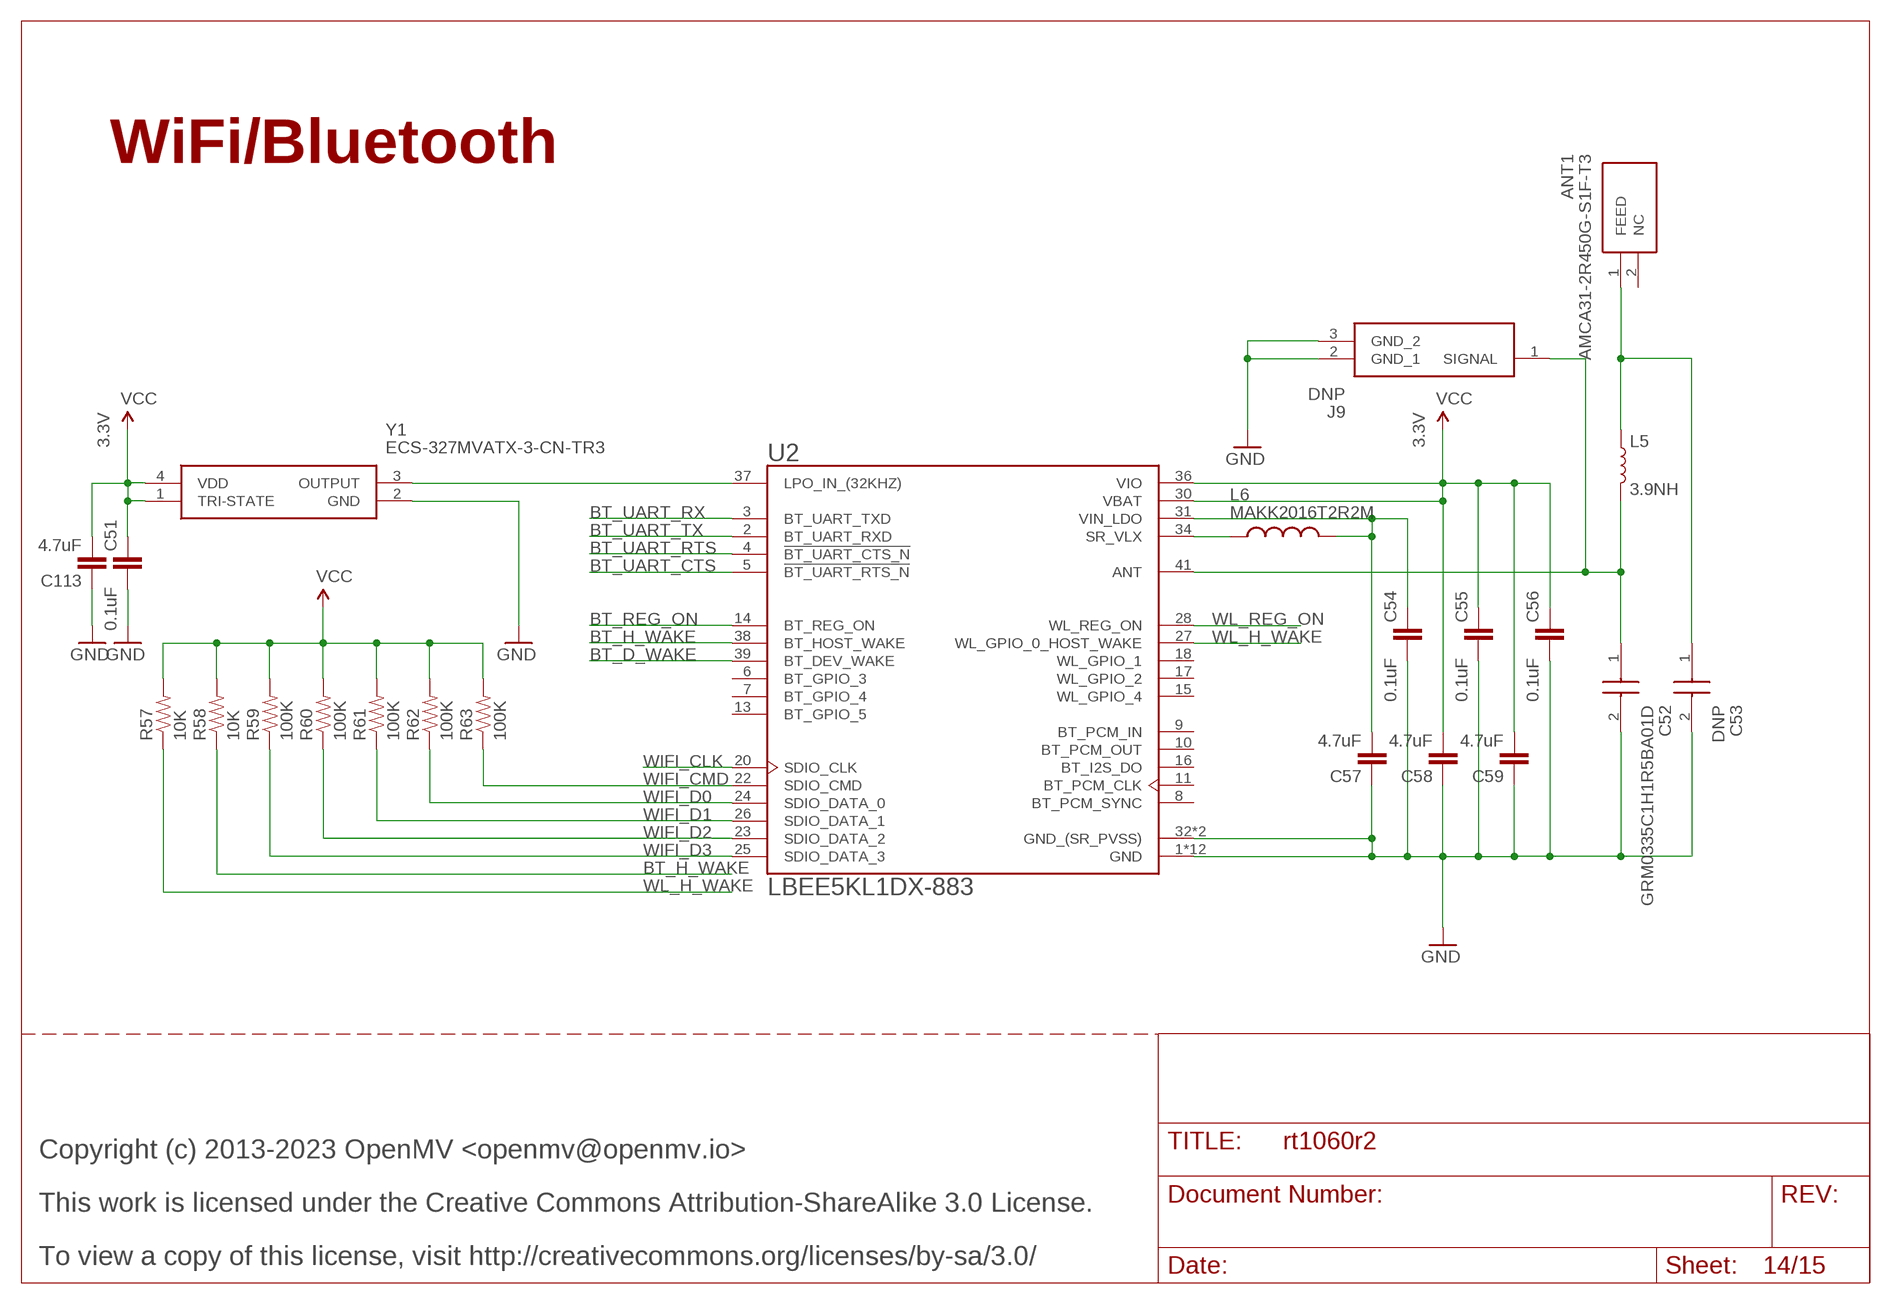
[diagram p13: schematic, sheet 14]

### Parts
ANT1  AMCA31-2R450G-S1F-T3  [ANTC3216X140N]
C51  0.1uF  CAP_0402  [0402]
C52  GRM0335C1H1R5BA01D  [CAPC0603X33N]
C53  DNP  GRM0335C1H1R5BA01D  [CAPC0603X33N]
C54  0.1uF  CAP_0402  [0402]
C55  0.1uF  CAP_0402  [0402]
C56  0.1uF  CAP_0402  [0402]
C57  4.7uF  CAP_0402  [0402]
C58  4.7uF  CAP_0402  [0402]
C59  4.7uF  CAP_0402  [0402]
C113  4.7uF  CAP_0402  [0402]
J9  DNP  2337019-1  [23370191]
L5  3.9NH  INDUCTOR-0402-3.9NH  [0402]
L6  MAKK2016T2R2M  [INDC2016X100N]
R57  10K  RES_0402  [0402]
R58  10K  RES_0402  [0402]
R59  100K  RES_0402  [0402]
R60  100K  RES_0402  [0402]
R61  100K  RES_0402  [0402]
R62  100K  RES_0402  [0402]
R63  100K  RES_0402  [0402]
U2  LBEE5KL1DX-883  LBEE5KL1DX-TEMP  [XCVR_LBEE5KL1DX-TEMP]
Y1  ECS-327MVATX-3-CN-TR3  [ECS327MVATX3CNTR3]

### Nets
ANT: C52.1 J9.1(SIGNAL) L5.2 U2.41(ANT)
BT_D_WAKE: U2.39(BT_DEV_WAKE) ; also sheet 15
BT_H_WAKE: R58.1 U2.38(BT_HOST_WAKE) ; also sheet 15
BT_REG_ON: U2.14(BT_REG_ON) ; also sheet 12,15
BT_UART_CTS: U2.5(!BT_UART_RTS_N) ; also sheet 15
BT_UART_RTS: U2.4(!BT_UART_CTS_N) ; also sheet 15
BT_UART_RX: U2.3(BT_UART_TXD) ; also sheet 15
BT_UART_TX: U2.2(BT_UART_RXD) ; also sheet 15
FEED: ANT1.1(FEED) C53.1 L5.1
GND [gnd]: C51.2 C52.2 C53.2 C54.2 C55.2 C56.2 C57.1 C58.1 C59.1 C113.1 J9.2(GND_1) J9.3(GND_2) U2.1(GND) U2.12(GND) U2.19(GND) U2.21(GND) U2.29(GND) U2.32(GND_(SR_PVSS)) U2.33(GND_(SR_PVSS)) U2.35(GND) U2.40(GND) U2.42(GND) U2.43(GND) U2.44(GND) U2.45(GND) U2.46(GND) Y1.2(GND) ; also sheet 1,2,3,4,5,6,7,8,9,10,11,12,13,15
LPO_IN: U2.37(LPO_IN_(32KHZ)) Y1.3(OUTPUT)
SR_VLX: L6.1 U2.34(SR_VLX)
VCC: C51.1 C55.1 C56.1 C58.2 C59.2 C113.2 R57.2 R58.2 R59.2 R60.2 R61.2 R62.2 R63.2 U2.30(VBAT) U2.36(VIO) Y1.1(TRI-STATE) Y1.4(VDD) ; also sheet 2,3,5,6,7,8,9,10,11,12,13,15
VIN_LDO: C54.1 C57.2 L6.2 U2.31(VIN_LDO)
WIFI_CLK [wifi]: U2.20(SDIO_CLK) ; also sheet 15
WIFI_CMD [wifi]: R63.1 U2.22(SDIO_CMD) ; also sheet 15
WIFI_D0 [wifi]: R62.1 U2.24(SDIO_DATA_0) ; also sheet 15
WIFI_D1 [wifi]: R61.1 U2.26(SDIO_DATA_1) ; also sheet 15
WIFI_D2 [wifi]: R60.1 U2.23(SDIO_DATA_2) ; also sheet 15
WIFI_D3 [wifi]: R59.1 U2.25(SDIO_DATA_3) ; also sheet 15
WL_H_WAKE: R57.1 U2.27(WL_GPIO_0_HOST_WAKE) ; also sheet 15
WL_REG_ON: U2.28(WL_REG_ON) ; also sheet 15
Unconnected: ANT1.2(NC) U2.6(BT_GPIO_3) U2.7(BT_GPIO_4) U2.8(BT_PCM_SYNC) U2.9(BT_PCM_IN) U2.10(BT_PCM_OUT) U2.11(BT_PCM_CLK) U2.13(BT_GPIO_5) U2.15(WL_GPIO_4) U2.16(BT_I2S_DO) U2.17(WL_GPIO_2) U2.18(WL_GPIO_1)

### Notes on the sheet
- WiFi/Bluetooth
- 3.3V | 3.3V
- Copyright (c) 2013-2023 OpenMV <openmv@openmv.io>
- This work is licensed under the Creative Commons Attribution-ShareAlike 3.0 License.
- To view a copy of this license, visit http://creativecommons.org/licenses/by-sa/3.0/

## Sheet 15 of 15
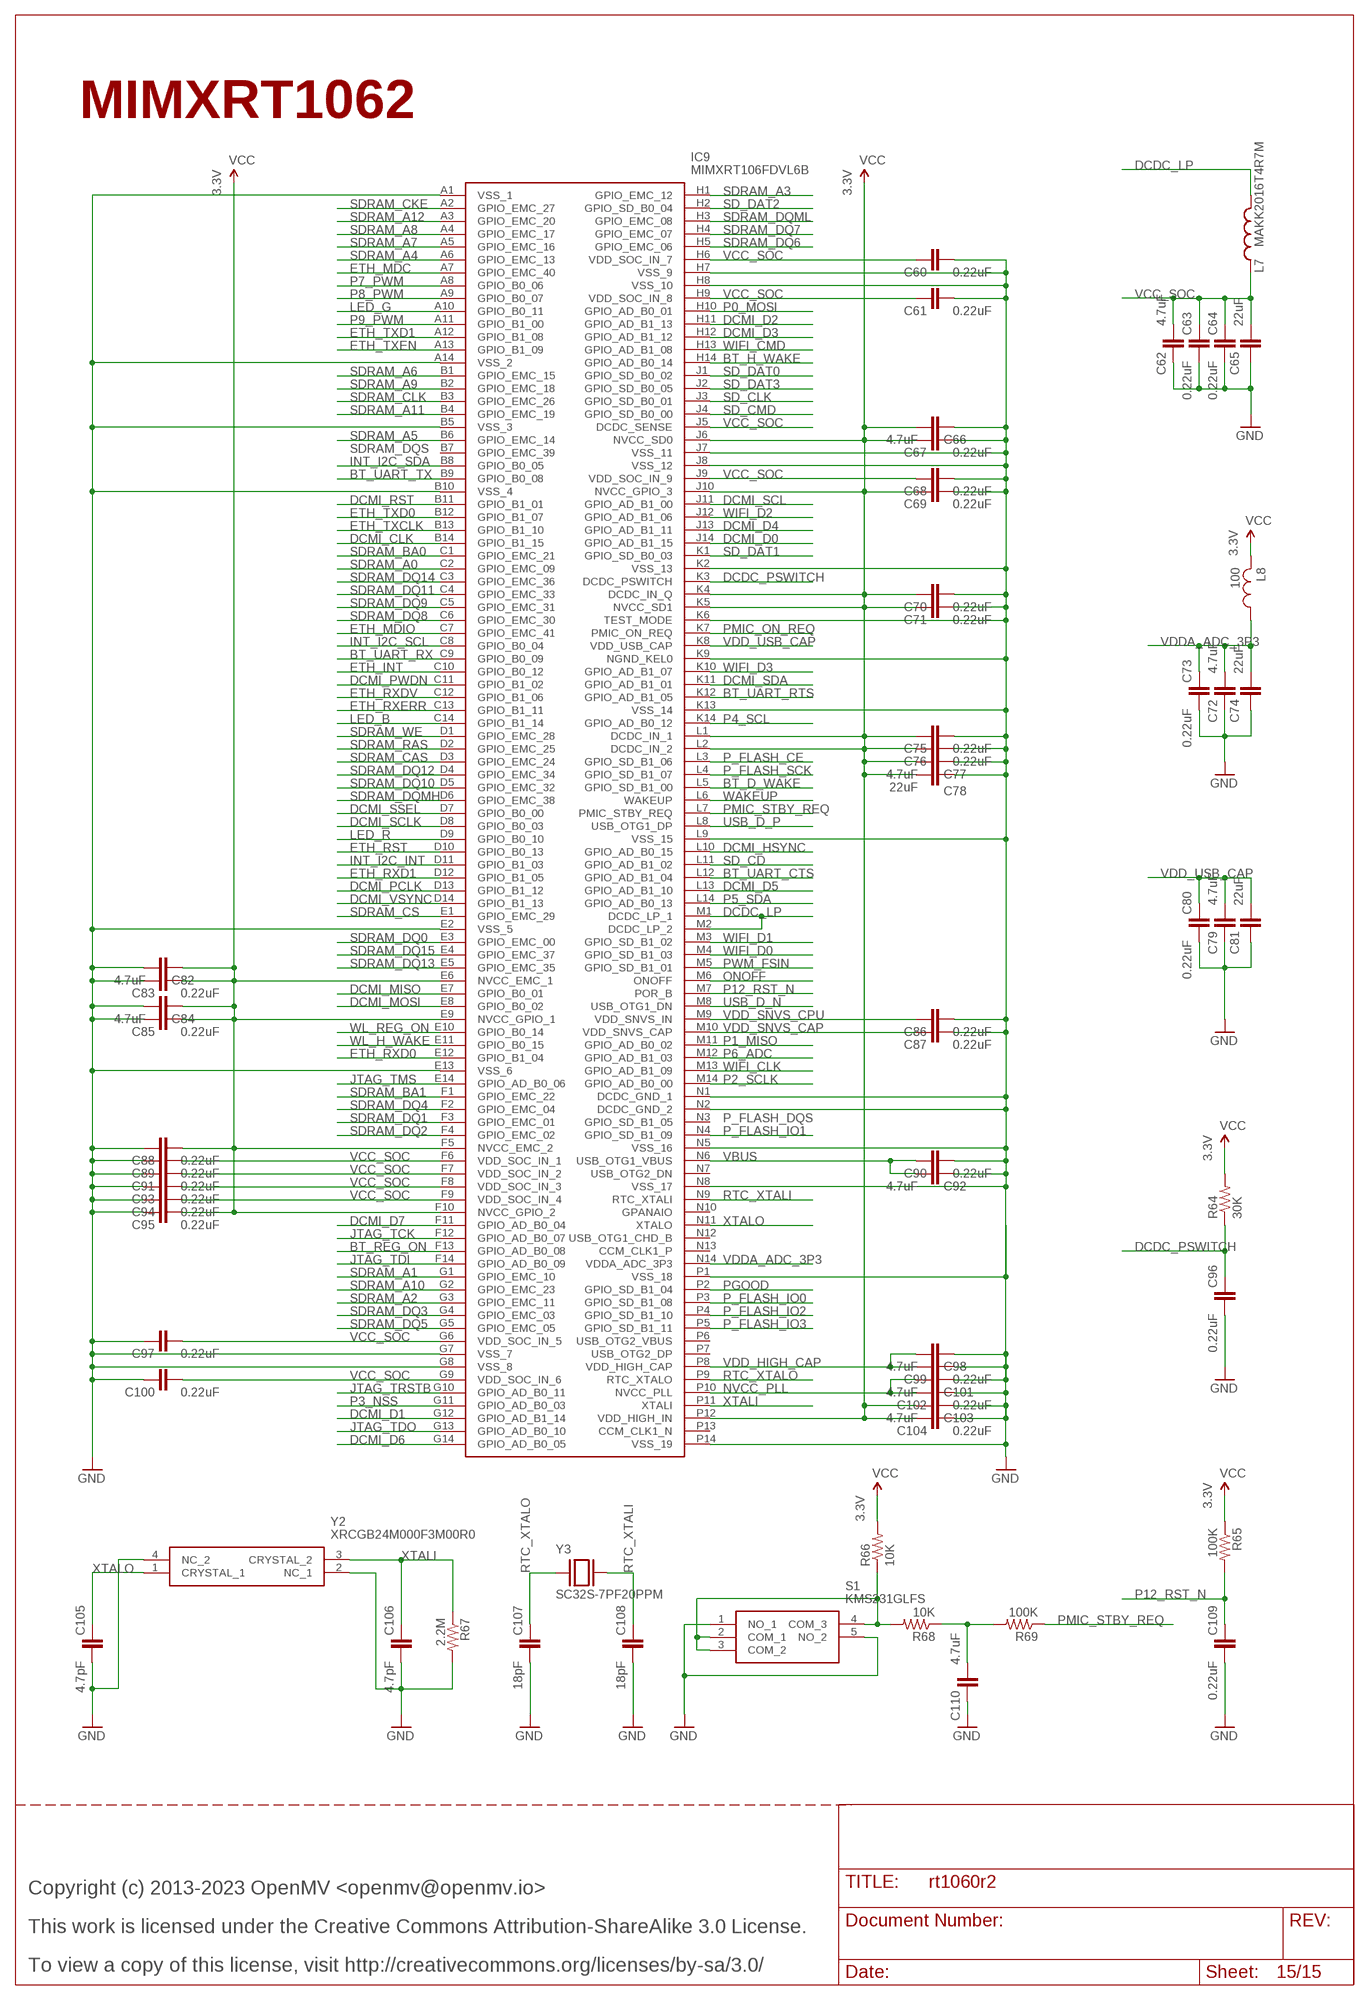
[diagram p14: schematic, sheet 15]

### Parts
C60  0.22uF  C-EUC0201  [C0201]
C61  0.22uF  C-EUC0201  [C0201]
C62  4.7uF  CAP_0402  [0402]
C63  0.22uF  C-EUC0201  [C0201]
C64  0.22uF  C-EUC0201  [C0201]
C65  22uF  22UF-0805-6.3V-20%  [0805]
C66  4.7uF  CAP_0402  [0402]
C67  0.22uF  C-EUC0201  [C0201]
C68  0.22uF  C-EUC0201  [C0201]
C69  0.22uF  C-EUC0201  [C0201]
C70  0.22uF  C-EUC0201  [C0201]
C71  0.22uF  C-EUC0201  [C0201]
C72  4.7uF  CAP_0402  [0402]
C73  0.22uF  C-EUC0201  [C0201]
C74  22uF  22UF-0805-6.3V-20%  [0805]
C75  0.22uF  C-EUC0201  [C0201]
C76  0.22uF  C-EUC0201  [C0201]
C77  4.7uF  CAP_0402  [0402]
C78  22uF  22UF-0805-6.3V-20%  [0805]
C79  4.7uF  CAP_0402  [0402]
C80  0.22uF  C-EUC0201  [C0201]
C81  22uF  22UF-0805-6.3V-20%  [0805]
C82  4.7uF  CAP_0402  [0402]
C83  0.22uF  C-EUC0201  [C0201]
C84  4.7uF  CAP_0402  [0402]
C85  0.22uF  C-EUC0201  [C0201]
C86  0.22uF  C-EUC0201  [C0201]
C87  0.22uF  C-EUC0201  [C0201]
C88  0.22uF  C-EUC0201  [C0201]
C89  0.22uF  C-EUC0201  [C0201]
C90  0.22uF  C-EUC0201  [C0201]
C91  0.22uF  C-EUC0201  [C0201]
C92  4.7uF  CAP_0402  [0402]
C93  0.22uF  C-EUC0201  [C0201]
C94  0.22uF  C-EUC0201  [C0201]
C95  0.22uF  C-EUC0201  [C0201]
C96  0.22uF  C-EUC0201  [C0201]
C97  0.22uF  C-EUC0201  [C0201]
C98  4.7uF  CAP_0402  [0402]
C99  0.22uF  C-EUC0201  [C0201]
C100  0.22uF  C-EUC0201  [C0201]
C101  4.7uF  CAP_0402  [0402]
C102  0.22uF  C-EUC0201  [C0201]
C103  4.7uF  CAP_0402  [0402]
C104  0.22uF  C-EUC0201  [C0201]
C105  4.7pF  C-EUC0201  [C0201]
C106  4.7pF  C-EUC0201  [C0201]
C107  18pF  C-EUC0201  [C0201]
C108  18pF  C-EUC0201  [C0201]
C109  0.22uF  C-EUC0201  [C0201]
C110  4.7uF  CAP_0402  [0402]
IC9  MIMXRT106FDVL6B  MIMXRT1052DVL6B  [BGA196C65P14X14_1000X1000X143]
L7  MAKK2016T4R7M  [INDC2016X100N]
L8  100  INDUCTOR_0402  [0402]
R64  30K  RES_0402  [0402]
R65  100K  RES_0402  [0402]
R66  10K  RES_0402  [0402]
R67  2.2M  RES_0402  [0402]
R68  10K  RES_0402  [0402]
R69  100K  RES_0402  [0402]
S1  KMS231GLFS  [KMS231GLFS]
Y2  XRCGB24M000F3M00R0  [XRCGB24M000F3M00R0]
Y3  SC32S-7PF20PPM  ABS07-32.768KHZ-7-T  [XTAL_ABS07-32.768KHZ-7-T]

### Nets
BT_D_WAKE: IC9.L5(GPIO_SD_B1_00) ; also sheet 14
BT_H_WAKE: IC9.H14(GPIO_AD_B0_14) ; also sheet 14
BT_REG_ON: IC9.F13(GPIO_AD_B0_08) ; also sheet 12,14
BT_UART_CTS: IC9.L12(GPIO_AD_B1_04) ; also sheet 14
BT_UART_RTS: IC9.K12(GPIO_AD_B1_05) ; also sheet 14
BT_UART_RX: IC9.C9(GPIO_B0_09) ; also sheet 14
BT_UART_TX: IC9.B9(GPIO_B0_08) ; also sheet 14
DCDC_LP: IC9.M1(DCDC_LP_1) IC9.M2(DCDC_LP_2) L7.2
DCDC_PSWITCH: C96.1 IC9.K3(DCDC_PSWITCH) R64.1
DCMI_CLK: IC9.B14(GPIO_B1_15) ; also sheet 10
DCMI_D0 [dcmi]: IC9.J14(GPIO_AD_B1_15) ; also sheet 10
DCMI_D1 [dcmi]: IC9.G12(GPIO_AD_B1_14) ; also sheet 10
DCMI_D2 [dcmi]: IC9.H11(GPIO_AD_B1_13) ; also sheet 10
DCMI_D3 [dcmi]: IC9.H12(GPIO_AD_B1_12) ; also sheet 10
DCMI_D4 [dcmi]: IC9.J13(GPIO_AD_B1_11) ; also sheet 10
DCMI_D5 [dcmi]: IC9.L13(GPIO_AD_B1_10) ; also sheet 10
DCMI_D6 [dcmi]: IC9.G14(GPIO_AD_B0_05) ; also sheet 10
DCMI_D7 [dcmi]: IC9.F11(GPIO_AD_B0_04) ; also sheet 10,11
DCMI_HSYNC [dcmi]: IC9.L10(GPIO_AD_B0_15) ; also sheet 10
DCMI_MISO [spi]: IC9.E7(GPIO_B0_01) ; also sheet 10
DCMI_MOSI [spi]: IC9.E8(GPIO_B0_02) ; also sheet 10
DCMI_PCLK [dcmi]: IC9.D13(GPIO_B1_12) ; also sheet 10
DCMI_PWDN: IC9.C11(GPIO_B1_02) ; also sheet 10
DCMI_RST: IC9.B11(GPIO_B1_01) ; also sheet 10
DCMI_SCL [i2c]: IC9.J11(GPIO_AD_B1_00) ; also sheet 10
DCMI_SCLK [spi]: IC9.D8(GPIO_B0_03) ; also sheet 10
DCMI_SDA [i2c]: IC9.K11(GPIO_AD_B1_01) ; also sheet 10
DCMI_SSEL [spi]: IC9.D7(GPIO_B0_00) ; also sheet 10
DCMI_VSYNC [dcmi]: IC9.D14(GPIO_B1_13) ; also sheet 10
ETH_INT: IC9.C10(GPIO_B0_12) ; also sheet 13
ETH_MDC [mdio]: IC9.A7(GPIO_EMC_40) ; also sheet 13
ETH_MDIO [mdio]: IC9.C7(GPIO_EMC_41) ; also sheet 13
ETH_RST: IC9.D10(GPIO_B0_13) ; also sheet 13
ETH_RXD0 [eth]: IC9.E12(GPIO_B1_04) ; also sheet 13
ETH_RXD1 [eth]: IC9.D12(GPIO_B1_05) ; also sheet 13
ETH_RXDV [eth]: IC9.C12(GPIO_B1_06) ; also sheet 13
ETH_RXERR [eth]: IC9.C13(GPIO_B1_11) ; also sheet 13
ETH_TXCLK [eth]: IC9.B13(GPIO_B1_10) ; also sheet 13
ETH_TXD0 [eth]: IC9.B12(GPIO_B1_07) ; also sheet 13
ETH_TXD1 [eth]: IC9.A12(GPIO_B1_08) ; also sheet 13
ETH_TXEN [eth]: IC9.A13(GPIO_B1_09) ; also sheet 13
GND [gnd]: C60.2 C61.2 C62.1 C63.2 C64.2 C65.1 C66.1 C67.2 C68.2 C69.2 C70.2 C71.2 C72.1 C73.2 C74.1 C75.2 C76.2 C77.1 C78.1 C79.1 C80.2 C81.1 C82.2 C83.1 C84.2 C85.1 C86.2 C87.2 C88.1 C89.1 C90.2 C91.1 C92.1 C93.1 C94.1 C95.1 C96.2 C97.1 C98.1 C99.2 C100.1 C101.1 C102.2 C103.1 C104.2 C105.2 C106.2 C107.2 C108.2 C109.2 C110.1 IC9.A1(VSS_1) IC9.A14(VSS_2) IC9.B5(VSS_3) IC9.B10(VSS_4) IC9.E2(VSS_5) IC9.E13(VSS_6) IC9.G7(VSS_7) IC9.G8(VSS_8) IC9.H7(VSS_9) IC9.H8(VSS_10) IC9.J7(VSS_11) IC9.J8(VSS_12) IC9.K2(VSS_13) IC9.K6(TEST_MODE) IC9.K9(NGND_KEL0) IC9.K13(VSS_14) IC9.L9(VSS_15) IC9.N1(DCDC_GND_1) IC9.N2(DCDC_GND_2) IC9.N5(VSS_16) IC9.N8(VSS_17) IC9.P1(VSS_18) IC9.P14(VSS_19) R67.2 S1.1(NO_1) S1.5(NO_2) Y2.2(NC_1) Y2.4(NC_2) ; also sheet 1,2,3,4,5,6,7,8,9,10,11,12,13,14
INT_I2C_INT: IC9.D11(GPIO_B1_03) ; also sheet 8
INT_I2C_SCL [i2c]: IC9.C8(GPIO_B0_04) ; also sheet 8
INT_I2C_SDA [i2c]: IC9.B8(GPIO_B0_05) ; also sheet 8
JTAG_TCK [jtag]: IC9.F12(GPIO_AD_B0_07) ; also sheet 12
JTAG_TDI [jtag]: IC9.F14(GPIO_AD_B0_09) ; also sheet 12
JTAG_TDO [jtag]: IC9.G13(GPIO_AD_B0_10) ; also sheet 12
JTAG_TMS [jtag]: IC9.E14(GPIO_AD_B0_06) ; also sheet 12
JTAG_TRSTB [jtag]: IC9.G10(GPIO_AD_B0_11) ; also sheet 12
LED_B: IC9.C14(GPIO_B1_14) ; also sheet 7
LED_G: IC9.A10(GPIO_B0_11) ; also sheet 7
LED_R: IC9.D9(GPIO_B0_10) ; also sheet 7
NVCC_PLL: C101.2 C102.1 IC9.P10(NVCC_PLL)
ONOFF: IC9.M6(ONOFF) ; also sheet 4
P0_MOSI [spi]: IC9.H10(GPIO_AD_B0_01) ; also sheet 11
P1_MISO [spi]: IC9.M11(GPIO_AD_B0_02) ; also sheet 11
P2_SCLK [spi]: IC9.M14(GPIO_AD_B0_00) ; also sheet 11
P3_NSS [spi]: IC9.G11(GPIO_AD_B0_03) ; also sheet 11
P4_SCL [i2c]: IC9.K14(GPIO_AD_B0_12) ; also sheet 11
P5_SDA [i2c]: IC9.L14(GPIO_AD_B0_13) ; also sheet 11
P6_ADC: IC9.M12(GPIO_AD_B1_03) ; also sheet 11
P7_PWM: IC9.A8(GPIO_B0_06) ; also sheet 11
P8_PWM: IC9.A9(GPIO_B0_07) ; also sheet 11
P9_PWM: IC9.A11(GPIO_B1_00) ; also sheet 11
P12_RST_N: C109.1 IC9.M7(POR_B) R65.2 ; also sheet 12
P_FLASH_CE [flash]: IC9.L3(GPIO_SD_B1_06) ; also sheet 7
P_FLASH_IO0 [flash]: IC9.P3(GPIO_SD_B1_08) ; also sheet 7
P_FLASH_IO1 [flash]: IC9.N4(GPIO_SD_B1_09) ; also sheet 7
P_FLASH_IO2 [flash]: IC9.P4(GPIO_SD_B1_10) ; also sheet 7
P_FLASH_IO3 [flash]: IC9.P5(GPIO_SD_B1_11) ; also sheet 7
P_FLASH_SCK [flash]: IC9.L4(GPIO_SD_B1_07) ; also sheet 7
PGOOD: IC9.P2(GPIO_SD_B1_04) ; also sheet 3
PMIC_ON_REQ: IC9.K7(PMIC_ON_REQ) ; also sheet 5
PMIC_STBY_REQ: IC9.L7(PMIC_STBY_REQ) R69.1
PWM_FSIN: IC9.M5(GPIO_SD_B1_01) ; also sheet 10
RTC_XTALI: C108.1 IC9.N9(RTC_XTALI) Y3.2
RTC_XTALO: C107.1 IC9.P9(RTC_XTALO) Y3.1
SD_CD: IC9.L11(GPIO_AD_B1_02) ; also sheet 9
SD_CLK [sdcard]: IC9.J3(GPIO_SD_B0_01) ; also sheet 9
SD_CMD [sdcard]: IC9.J4(GPIO_SD_B0_00) ; also sheet 9
SD_DAT0 [sdcard]: IC9.J1(GPIO_SD_B0_02) ; also sheet 9
SD_DAT1 [sdcard]: IC9.K1(GPIO_SD_B0_03) ; also sheet 9
SD_DAT2 [sdcard]: IC9.H2(GPIO_SD_B0_04) ; also sheet 9
SD_DAT3 [sdcard]: IC9.J2(GPIO_SD_B0_05) ; also sheet 9
SDRAM_A0 [sdram]: IC9.C2(GPIO_EMC_09) ; also sheet 6
SDRAM_A1 [sdram]: IC9.G1(GPIO_EMC_10) ; also sheet 6
SDRAM_A2 [sdram]: IC9.G3(GPIO_EMC_11) ; also sheet 6
SDRAM_A3 [sdram]: IC9.H1(GPIO_EMC_12) ; also sheet 6
SDRAM_A4 [sdram]: IC9.A6(GPIO_EMC_13) ; also sheet 6
SDRAM_A5 [sdram]: IC9.B6(GPIO_EMC_14) ; also sheet 6
SDRAM_A6 [sdram]: IC9.B1(GPIO_EMC_15) ; also sheet 6
SDRAM_A7 [sdram]: IC9.A5(GPIO_EMC_16) ; also sheet 6
SDRAM_A8 [sdram]: IC9.A4(GPIO_EMC_17) ; also sheet 6
SDRAM_A9 [sdram]: IC9.B2(GPIO_EMC_18) ; also sheet 6
SDRAM_A10 [sdram]: IC9.G2(GPIO_EMC_23) ; also sheet 6
SDRAM_A11 [sdram]: IC9.B4(GPIO_EMC_19) ; also sheet 6
SDRAM_A12 [sdram]: IC9.A3(GPIO_EMC_20) ; also sheet 6
SDRAM_BA0 [sdram]: IC9.C1(GPIO_EMC_21) ; also sheet 6
SDRAM_BA1 [sdram]: IC9.F1(GPIO_EMC_22) ; also sheet 6
SDRAM_CAS [sdram]: IC9.D3(GPIO_EMC_24) ; also sheet 6
SDRAM_CKE [sdram]: IC9.A2(GPIO_EMC_27) ; also sheet 6
SDRAM_CLK [sdram]: IC9.B3(GPIO_EMC_26) ; also sheet 6
SDRAM_CS [sdram]: IC9.E1(GPIO_EMC_29) ; also sheet 6
SDRAM_DQ0 [sdram]: IC9.E3(GPIO_EMC_00) ; also sheet 6
SDRAM_DQ1 [sdram]: IC9.F3(GPIO_EMC_01) ; also sheet 6
SDRAM_DQ2 [sdram]: IC9.F4(GPIO_EMC_02) ; also sheet 6
SDRAM_DQ3 [sdram]: IC9.G4(GPIO_EMC_03) ; also sheet 6
SDRAM_DQ4 [sdram]: IC9.F2(GPIO_EMC_04) ; also sheet 6
SDRAM_DQ5 [sdram]: IC9.G5(GPIO_EMC_05) ; also sheet 6
SDRAM_DQ6 [sdram]: IC9.H5(GPIO_EMC_06) ; also sheet 6
SDRAM_DQ7 [sdram]: IC9.H4(GPIO_EMC_07) ; also sheet 6
SDRAM_DQ8 [sdram]: IC9.C6(GPIO_EMC_30) ; also sheet 6
SDRAM_DQ9 [sdram]: IC9.C5(GPIO_EMC_31) ; also sheet 6
SDRAM_DQ10 [sdram]: IC9.D5(GPIO_EMC_32) ; also sheet 6
SDRAM_DQ11 [sdram]: IC9.C4(GPIO_EMC_33) ; also sheet 6
SDRAM_DQ12 [sdram]: IC9.D4(GPIO_EMC_34) ; also sheet 6
SDRAM_DQ13 [sdram]: IC9.E5(GPIO_EMC_35) ; also sheet 6
SDRAM_DQ14 [sdram]: IC9.C3(GPIO_EMC_36) ; also sheet 6
SDRAM_DQ15 [sdram]: IC9.E4(GPIO_EMC_37) ; also sheet 6
SDRAM_DQMH [sdram]: IC9.D6(GPIO_EMC_38) ; also sheet 6
SDRAM_DQML [sdram]: IC9.H3(GPIO_EMC_08) ; also sheet 6
SDRAM_RAS [sdram]: IC9.D2(GPIO_EMC_25) ; also sheet 6
SDRAM_WE [sdram]: IC9.D1(GPIO_EMC_28) ; also sheet 6
SWITCH: R66.1 R68.2 S1.2(COM_1) S1.3(COM_2) S1.4(COM_3)
SWITCH_OUT: C110.2 R68.1 R69.2
USB_D_N [usb]: IC9.M8(USB_OTG1_DN) ; also sheet 1
USB_D_P [usb]: IC9.L8(USB_OTG1_DP) ; also sheet 1
VBUS: C90.1 C92.2 IC9.N6(USB_OTG1_VBUS) ; also sheet 1,2
VCC: C66.2 C67.1 C69.1 C70.1 C71.1 C75.1 C76.1 C77.2 C78.2 C82.1 C83.2 C84.1 C85.2 C88.2 C95.2 C103.2 C104.1 IC9.E6(NVCC_EMC_1) IC9.E9(NVCC_GPIO_1) IC9.F5(NVCC_EMC_2) IC9.F10(NVCC_GPIO_2) IC9.J6(NVCC_SD0) IC9.J10(NVCC_GPIO_3) IC9.K4(DCDC_IN_Q) IC9.K5(NVCC_SD1) IC9.L1(DCDC_IN_1) IC9.L2(DCDC_IN_2) IC9.P12(VDD_HIGH_IN) L8.2 R64.2 R65.1 R66.2 ; also sheet 2,3,5,6,7,8,9,10,11,12,13,14
VCC_SOC: C60.1 C61.1 C62.2 C63.1 C64.1 C65.2 C68.1 C89.2 C91.2 C93.2 C94.2 C97.2 C100.2 IC9.F6(VDD_SOC_IN_1) IC9.F7(VDD_SOC_IN_2) IC9.F8(VDD_SOC_IN_3) IC9.F9(VDD_SOC_IN_4) IC9.G6(VDD_SOC_IN_5) IC9.G9(VDD_SOC_IN_6) IC9.H6(VDD_SOC_IN_7) IC9.H9(VDD_SOC_IN_8) IC9.J5(DCDC_SENSE) IC9.J9(VDD_SOC_IN_9) L7.1
VDD_HIGH_CAP: C98.2 C99.1 IC9.P8(VDD_HIGH_CAP)
VDD_SNVS_CAP: C87.1 IC9.M10(VDD_SNVS_CAP)
VDD_SNVS_CPU: C86.1 IC9.M9(VDD_SNVS_IN) ; also sheet 4,5
VDD_USB_CAP: C79.2 C80.1 C81.2 IC9.K8(VDD_USB_CAP)
VDDA_ADC_3P3: C72.2 C73.1 C74.2 IC9.N14(VDDA_ADC_3P3) L8.1
WAKEUP: IC9.L6(WAKEUP) ; also sheet 4
WIFI_CLK [wifi]: IC9.M13(GPIO_AD_B1_09) ; also sheet 14
WIFI_CMD [wifi]: IC9.H13(GPIO_AD_B1_08) ; also sheet 14
WIFI_D0 [wifi]: IC9.M4(GPIO_SD_B1_03) ; also sheet 14
WIFI_D1 [wifi]: IC9.M3(GPIO_SD_B1_02) ; also sheet 14
WIFI_D2 [wifi]: IC9.J12(GPIO_AD_B1_06) ; also sheet 14
WIFI_D3 [wifi]: IC9.K10(GPIO_AD_B1_07) ; also sheet 14
WL_H_WAKE: IC9.E11(GPIO_B0_15) ; also sheet 14
WL_REG_ON: IC9.E10(GPIO_B0_14) ; also sheet 14
XTALI: C106.1 IC9.P11(XTALI) R67.1 Y2.3(CRYSTAL_2)
XTALO: C105.1 IC9.N11(XTALO) Y2.1(CRYSTAL_1)
Unconnected: IC9.B7(GPIO_EMC_39) IC9.N3(GPIO_SD_B1_05) IC9.N7(USB_OTG2_DN) IC9.N10(GPANAIO) IC9.N12(USB_OTG1_CHD_B) IC9.N13(CCM_CLK1_P) IC9.P6(USB_OTG2_VBUS) IC9.P7(USB_OTG2_DP) IC9.P13(CCM_CLK1_N)

### Notes on the sheet
- MIMXRT1062
- 3.3V | 3.3V
- SDRAM_DQS
- 3.3V
- P_FLASH_DQS
- 3.3V
- 3.3V
- 3.3V
- Copyright (c) 2013-2023 OpenMV <openmv@openmv.io>
- This work is licensed under the Creative Commons Attribution-ShareAlike 3.0 License.
- To view a copy of this license, visit http://creativecommons.org/licenses/by-sa/3.0/